# EAGLE board tc08-6u (EAGLE 6.6.0), part 1 of 9
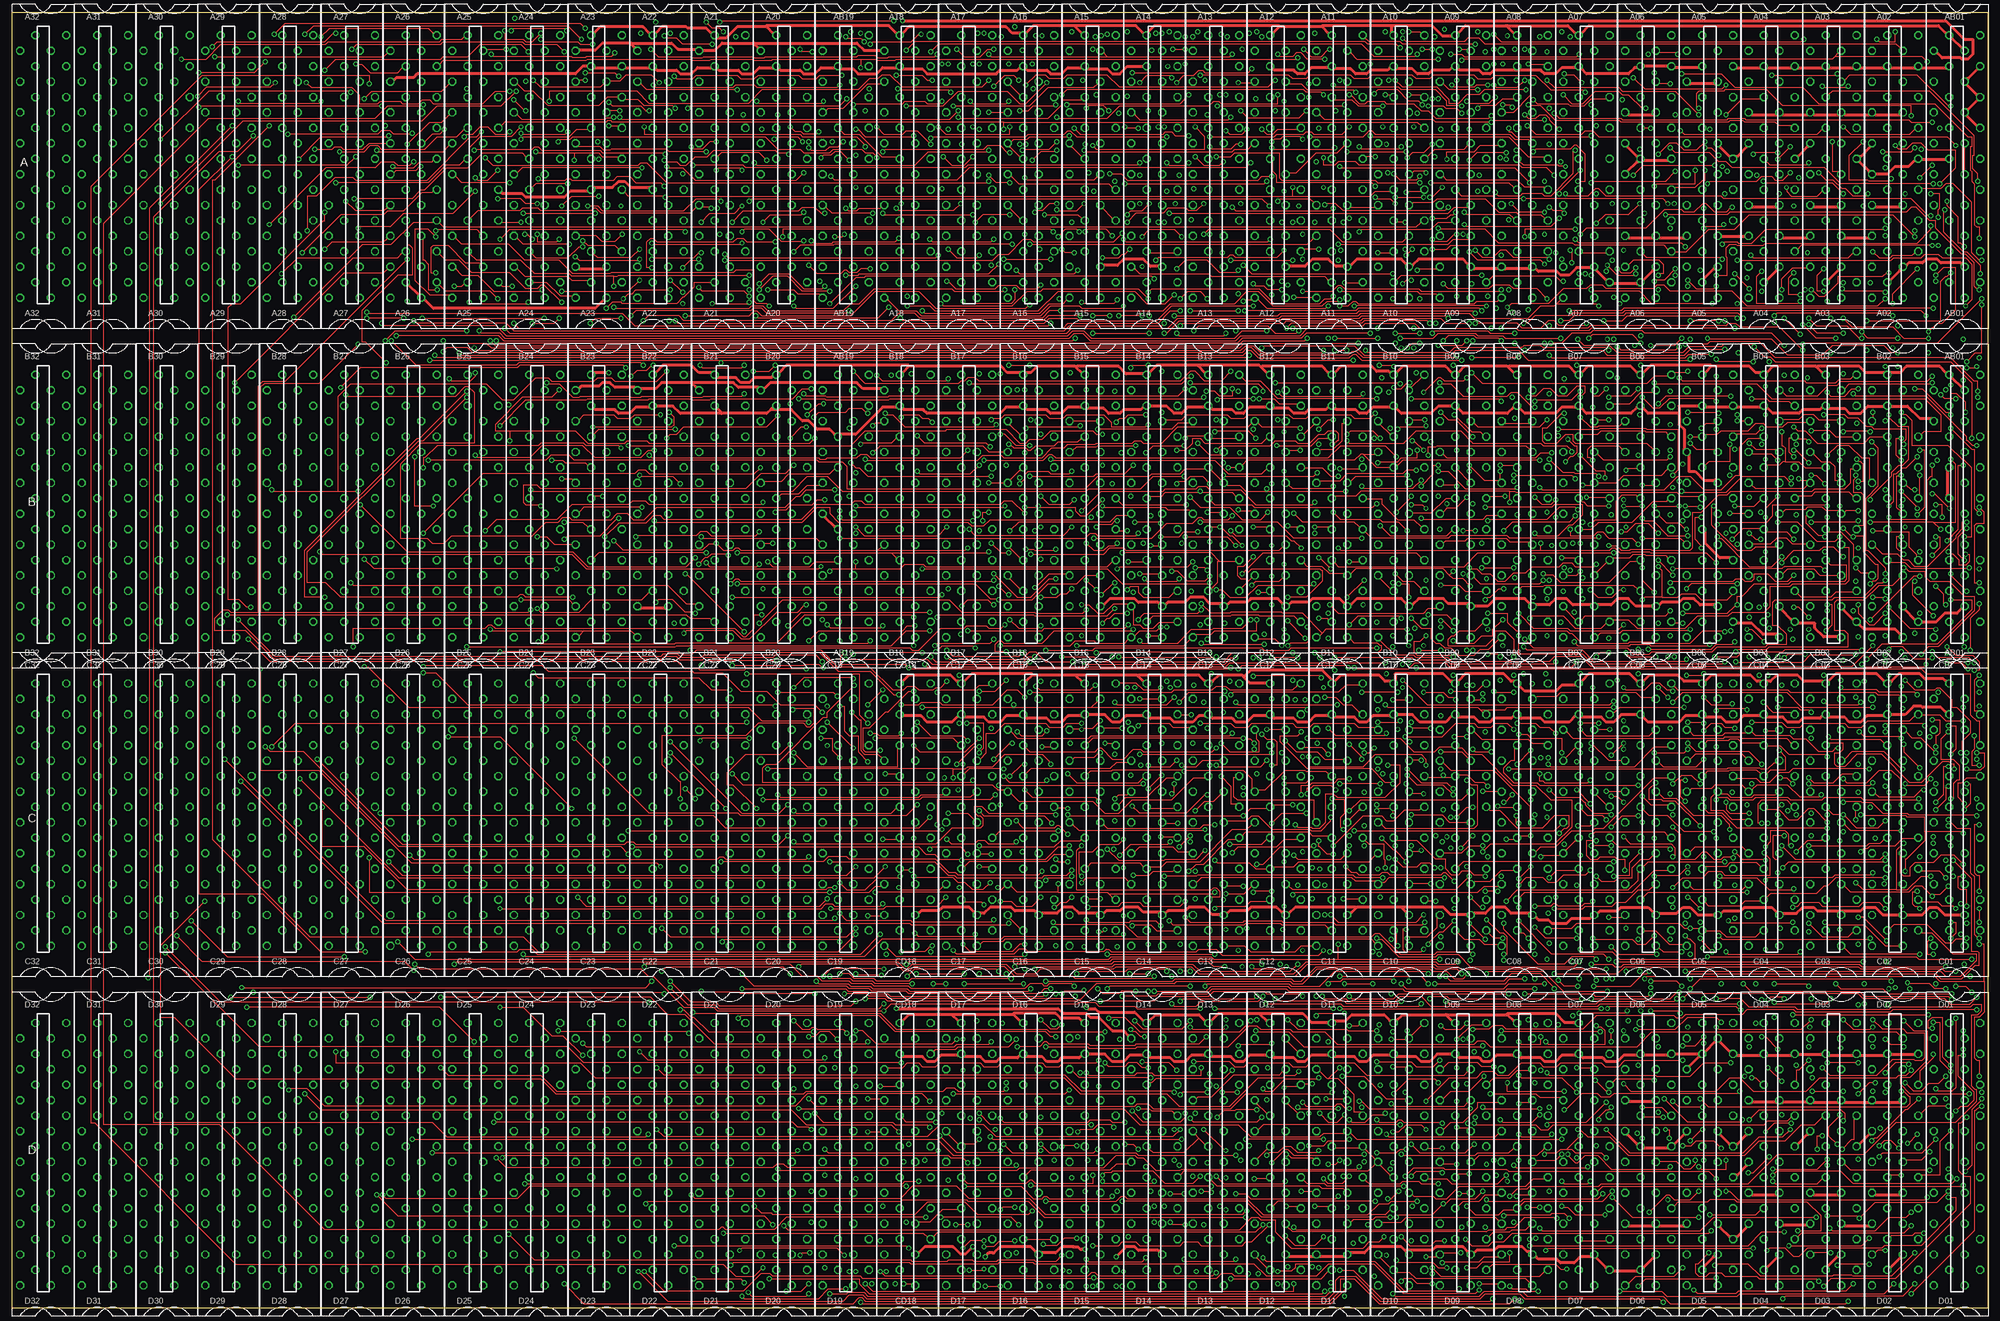
[diagram p12: board, top side]
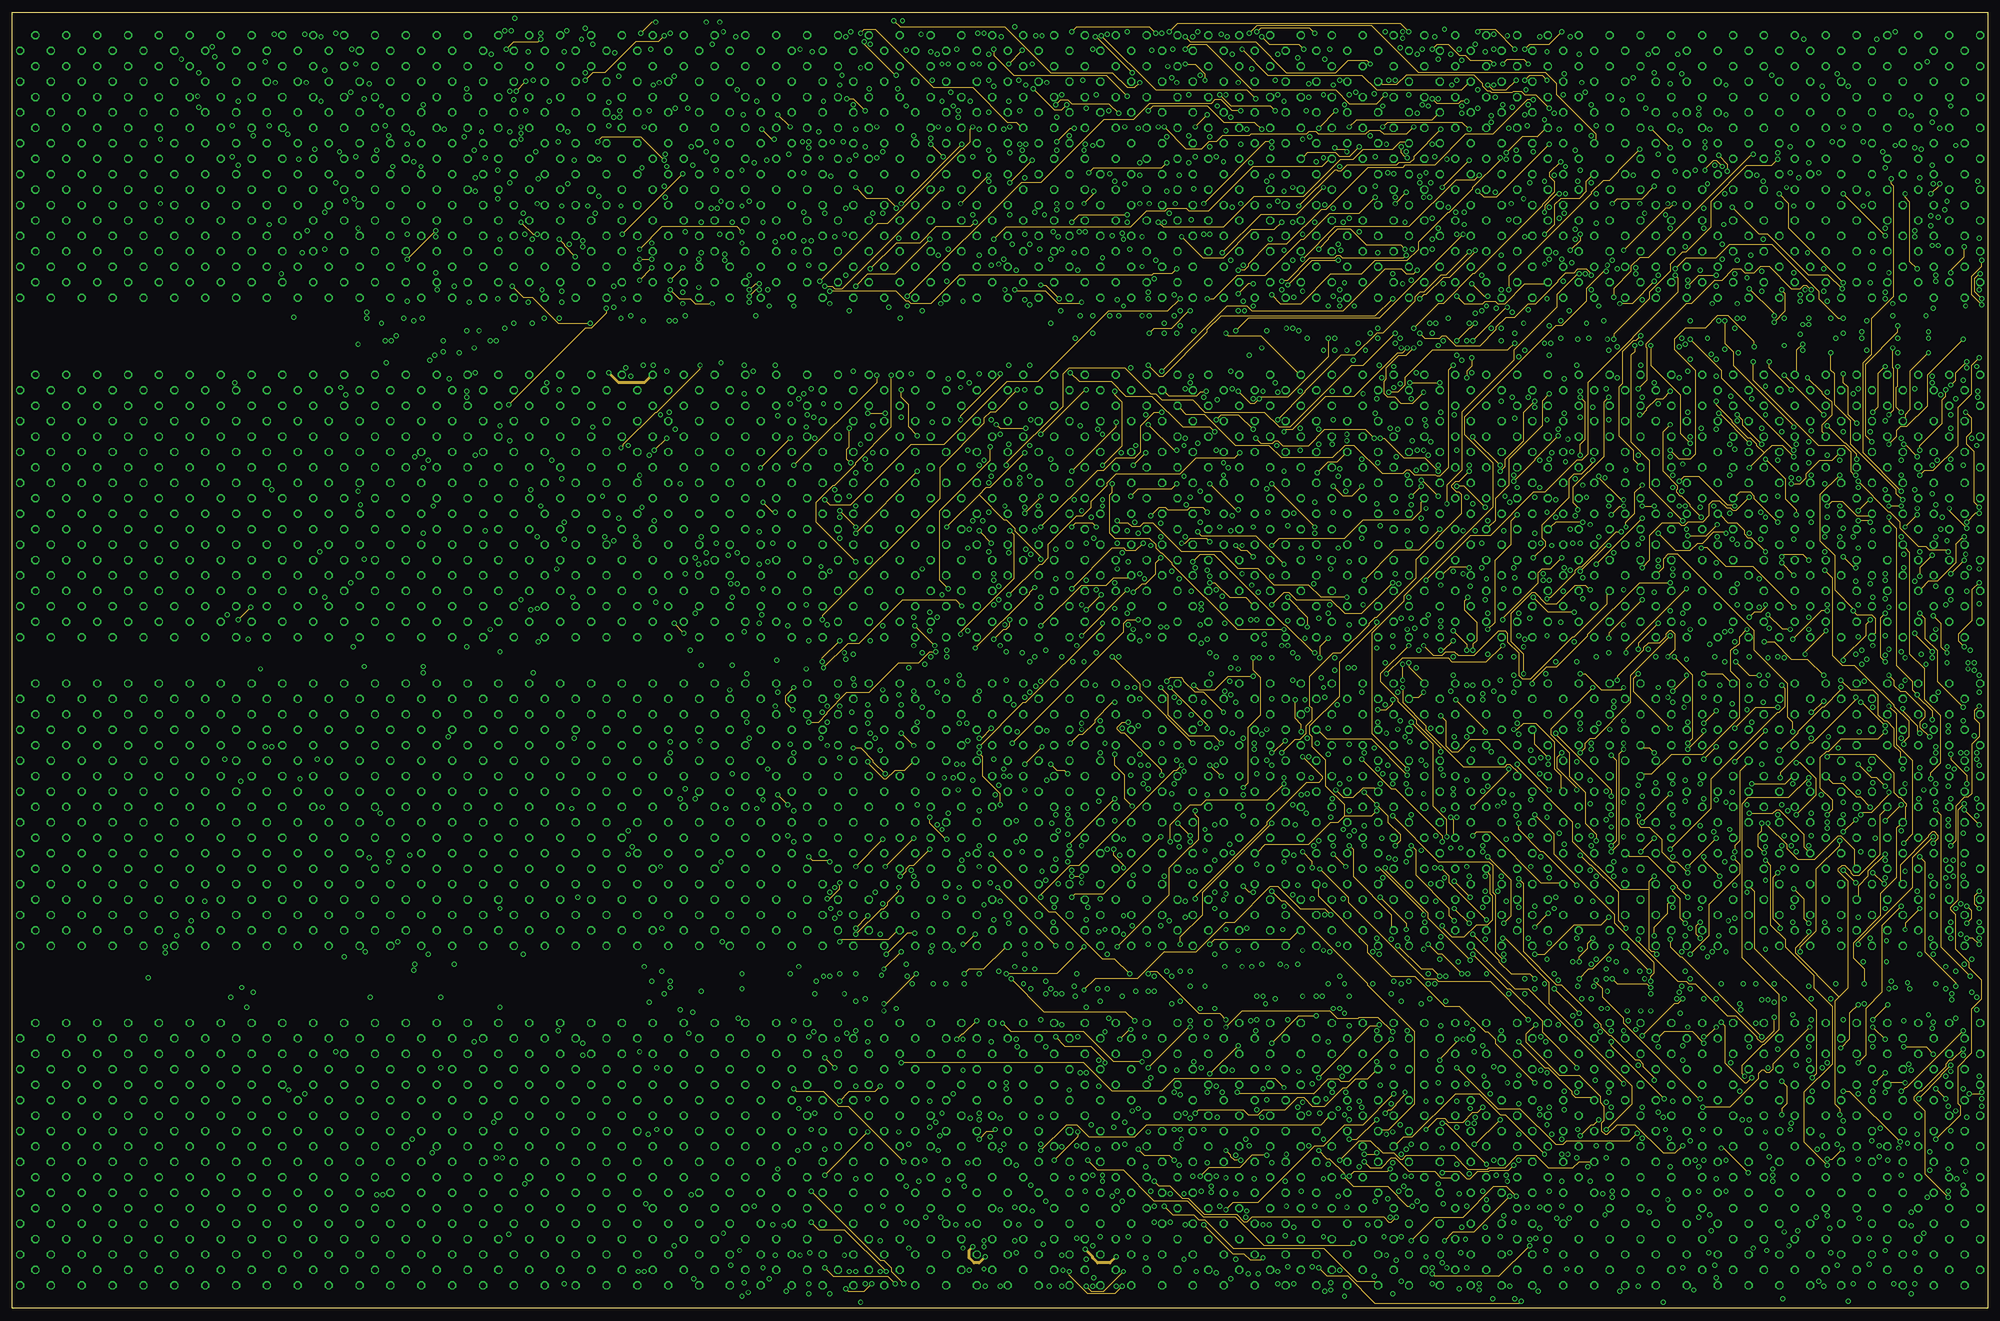
[diagram p13: board, inner layer Route2]
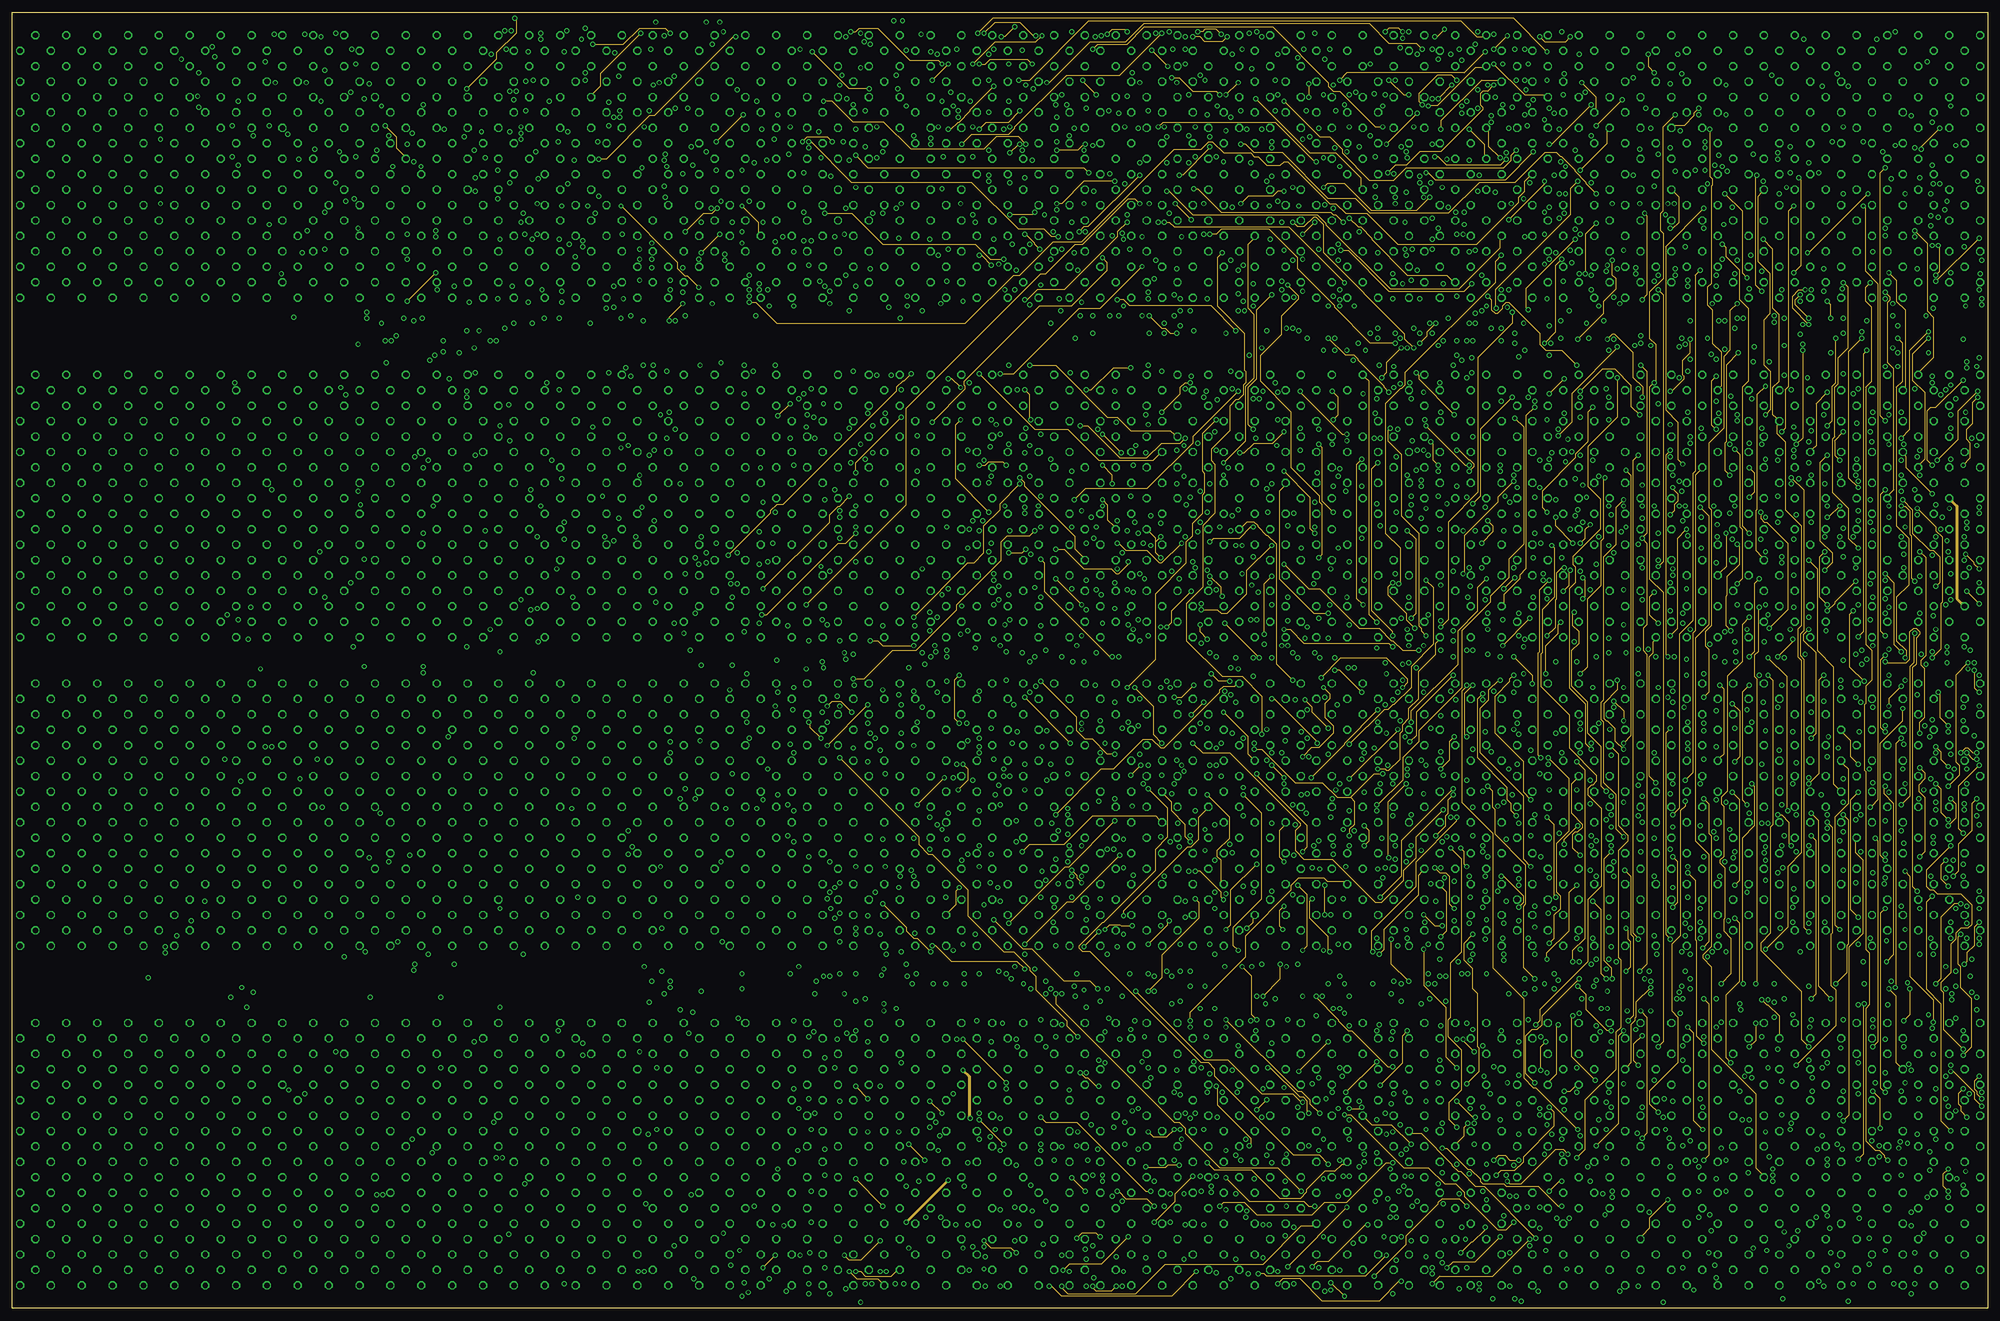
[diagram p14: board, inner layer Route15]
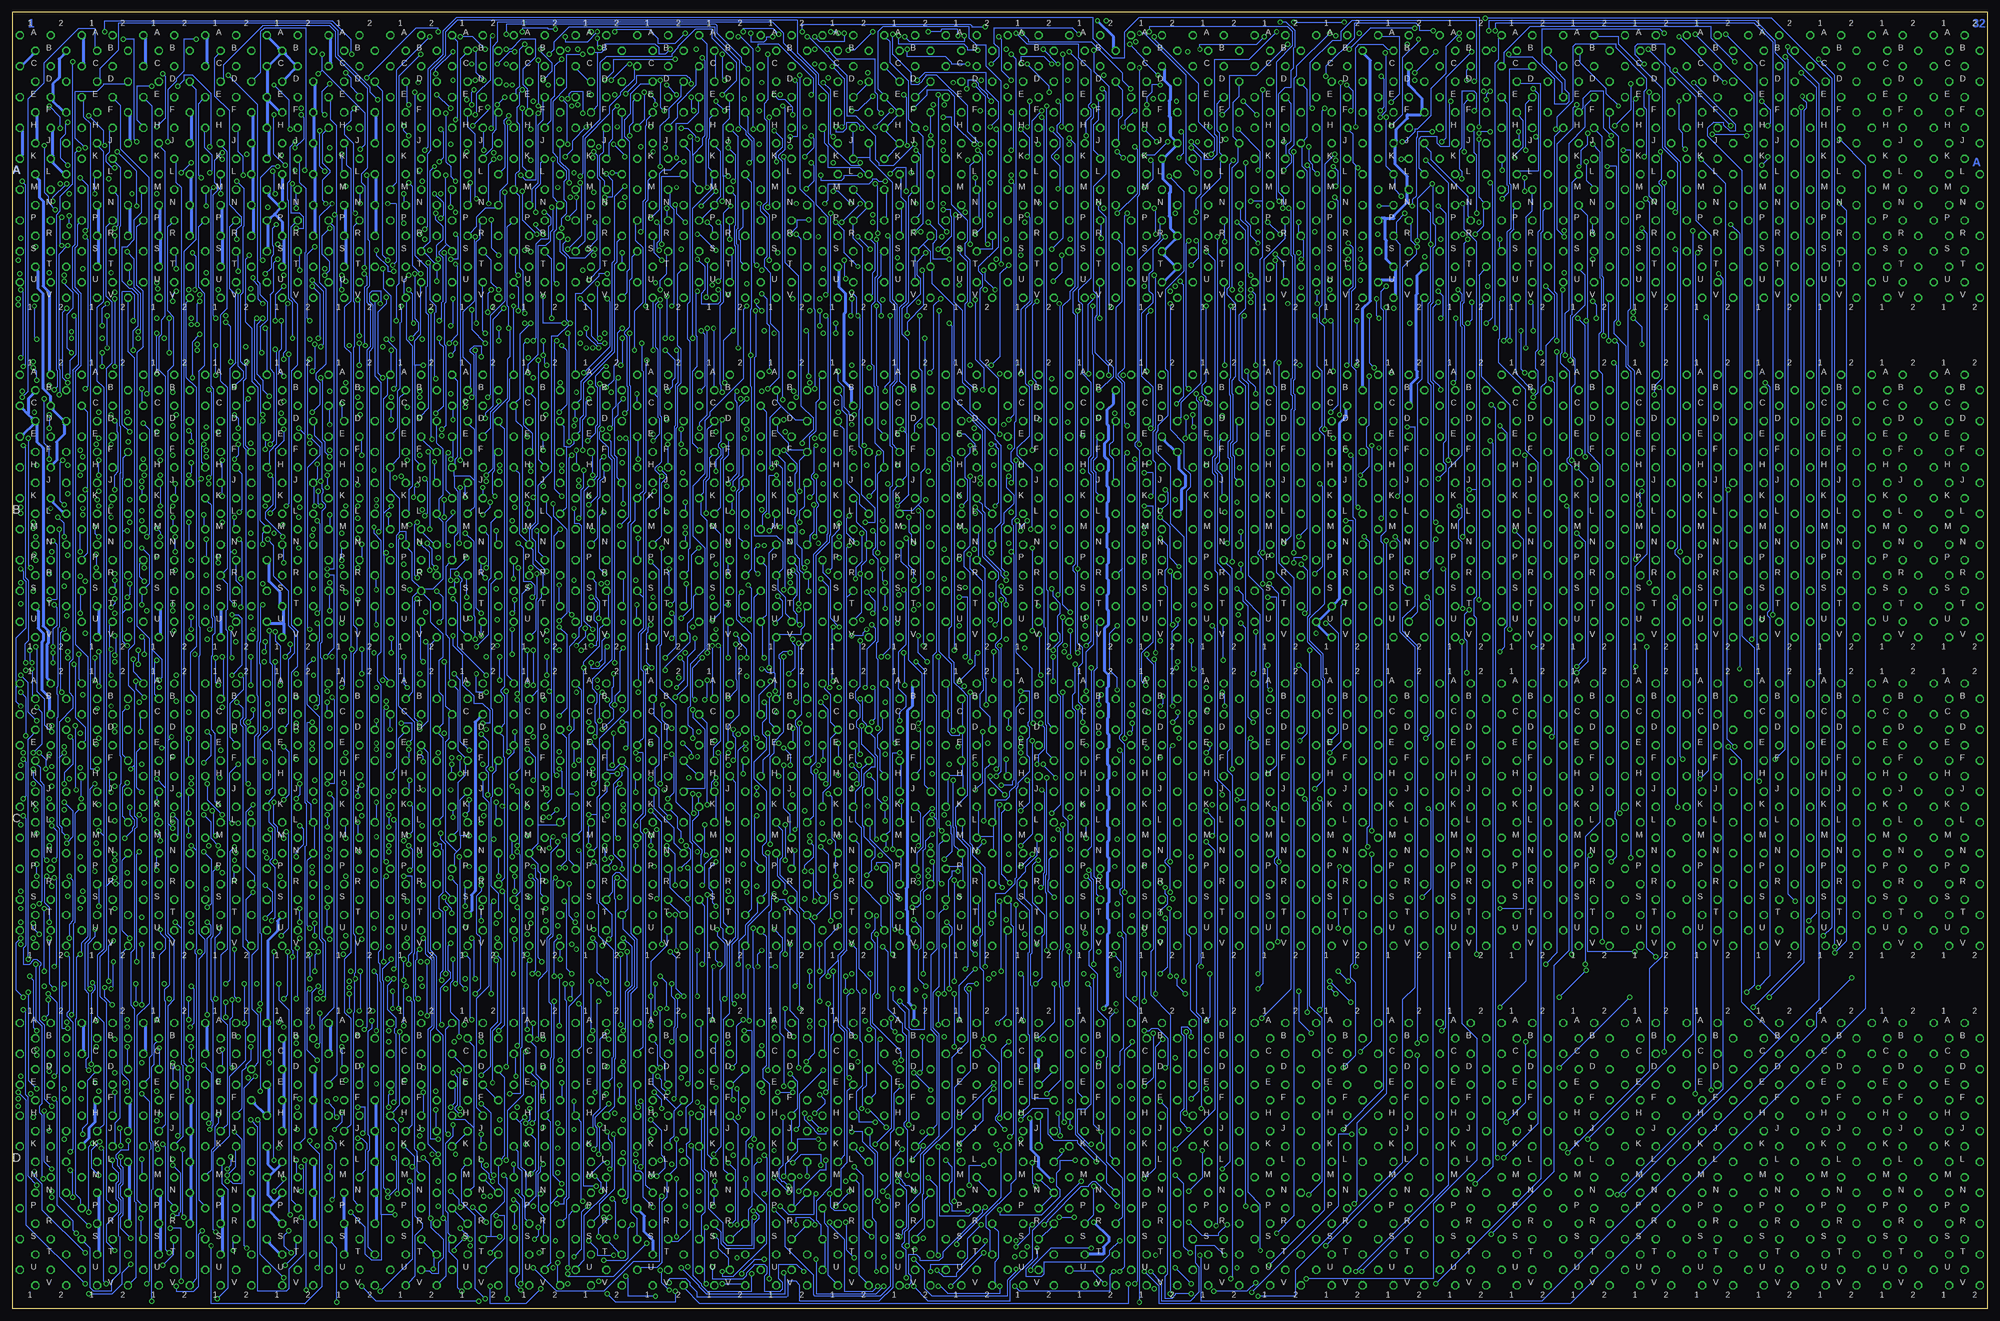
[diagram p15: board, bottom side, seen from below]

Size 406.46 x 266.69 mm. Coordinates in mm from the lower left corner, seen from the top.
Outline: 406.43,0 0,0 0.03,266.67 406.46,266.69 406.43,0
Copper layers (1*2*15*16): Top 0.035mm / dielectric 1.5mm / Route2 0.035mm / dielectric 0.15mm / Route15 0.035mm / dielectric 0.2mm / Bottom 0.035mm
Design rules "10mils": minimum track width 10mil, minimum drill 24mil, track to track 10mil, track to pad 10mil, pad to pad 10mil, via to via 10mil, smd to smd 10mil, copper to edge 25mil, drill to drill 10mil, minimum pad ring 10mil, minimum via ring 8mil, stop-mask expansion 0mil, vias tented up to drill 0mil, thermal gap 10mil
Net classes: 1 Power: width 0.635 mm, drill 0.381 mm, clearance 0.381 mm

## Footprints (pad centres in the part's own frame; a part is rotated, then mirrored left to right if it is on the bottom)
H807 = drill 1.092 octagon: A1 4.763,28.575; A2 -1.587,28.575; B1 1.587,25.4; B2 -4.763,25.4; C1 4.763,22.225; C2 -1.587,22.225; D1 1.587,19.05; D2 -4.763,19.05; E1 4.763,15.875; E2 -1.587,15.875; F1 1.587,12.7; F2 -4.763,12.7; H1 4.763,9.525; H2 -1.587,9.525; J1 1.587,6.35; J2 -4.763,6.35; K1 4.763,3.175; K2 -1.587,3.175; L1 1.587,0; L2 -4.763,0; M1 4.763,-3.175; M2 -1.587,-3.175; N1 1.587,-6.35; N2 -4.763,-6.35; P1 4.763,-9.525; P2 -1.587,-9.525; R1 1.587,-12.7; R2 -4.763,-12.7; S1 4.763,-15.875; S2 -1.587,-15.875; T1 1.587,-19.05; T2 -4.763,-19.05; U1 4.763,-22.225; U2 -1.587,-22.225; V1 1.587,-25.4; V2 -4.763,-25.4
H807-2 = drill 1.092 octagon: AA1 4.763,60.325; AA2 -1.587,60.325; AB1 1.587,57.15; AB2 -4.763,57.15; AC1 4.763,53.975; AC2 -1.587,53.975; AD1 1.587,50.8; AD2 -4.763,50.8; AE1 4.763,47.625; AE2 -1.587,47.625; AF1 1.587,44.45; AF2 -4.763,44.45; AH1 4.763,41.275; AH2 -1.587,41.275; AJ1 1.587,38.1; AJ2 -4.763,38.1; AK1 4.763,34.925; AK2 -1.587,34.925; AL1 1.587,31.75; AL2 -4.763,31.75; AM1 4.763,28.575; AM2 -1.587,28.575; AN1 1.587,25.4; AN2 -4.763,25.4; AP1 4.763,22.225; AP2 -1.587,22.225; AR1 1.587,19.05; AR2 -4.763,19.05; AS1 4.763,15.875; AS2 -1.587,15.875; AT1 1.587,12.7; AT2 -4.763,12.7; AU1 4.763,9.525; AU2 -1.587,9.525; AV1 1.587,6.35; AV2 -4.763,6.35; BA1 4.763,-9.525; BA2 -1.587,-9.525; BB1 1.587,-12.7; BB2 -4.763,-12.7; BC1 4.763,-15.875; BC2 -1.587,-15.875; BD1 1.587,-19.05; BD2 -4.763,-19.05; BE1 4.763,-22.225; BE2 -1.587,-22.225; BF1 1.587,-25.4; BF2 -4.763,-25.4; BH1 4.763,-28.575; BH2 -1.587,-28.575; BJ1 1.587,-31.75; BJ2 -4.763,-31.75; BK1 4.763,-34.925; BK2 -1.587,-34.925; BL1 1.587,-38.1; BL2 -4.763,-38.1; BM1 4.763,-41.275; BM2 -1.587,-41.275; BN1 1.587,-44.45; BN2 -4.763,-44.45; BP1 4.763,-47.625; BP2 -1.587,-47.625; BR1 1.587,-50.8; BR2 -4.763,-50.8; BS1 4.763,-53.975; BS2 -1.587,-53.975; BT1 1.587,-57.15; BT2 -4.763,-57.15; BU1 4.763,-60.325; BU2 -1.587,-60.325; BV1 1.587,-63.5; BV2 -4.763,-63.5

## Placement (x,y rotation side)
A02  M903  [H807]  387.39,233.35 0 top
A03  M903  [H807]  374.69,233.35 0 top
A04  M903  [H807]  361.99,233.35 0 top
A05  M903  [H807]  349.29,233.35 0 top
A06  M903  [H807]  336.59,233.35 0 top
A07  M161  [H807]  323.89,233.35 0 top
A08  M206  [H807]  311.19,233.35 0 top
A09  M117  [H807]  298.49,233.35 0 top
A10  M113  [H807]  285.79,233.35 0 top
A11  M111  [H807]  273.09,233.35 0 top
A12  M113  [H807]  260.39,233.35 0 top
A13  H807  [H807]  247.69,233.35 0 top
A14  M302  [H807]  234.99,233.35 0 top
A15  M627  [H807]  222.29,233.35 0 top
A16  M602  [H807]  209.59,233.35 0 top
A17  H807  [H807]  196.89,233.35 0 top
A18  G888  [H807]  184.19,233.35 0 top
A20  G888  [H807]  158.79,233.35 0 top
A21  G888  [H807]  146.09,233.35 0 top
A22  M502  [H807]  133.39,233.35 0 top
A23  M633  [H807]  120.69,233.35 0 top
A24  W023  [H807]  107.99,233.35 0 top
A25  M916  [H807]  95.29,233.35 0 top
A26  M916  [H807]  82.59,233.35 0 top
A27  H807  [H807]  69.89,233.35 0 top
A28  H807  [H807]  57.19,233.35 0 top
A29  H807  [H807]  44.49,233.35 0 top
A30  H807  [H807]  31.79,233.35 0 top
A31  H807  [H807]  19.09,233.35 0 top
A32  H807  [H807]  6.39,233.35 0 top
AB01  G821  [H807-2]  400.09,201.6 0 top
AB19  W032  [H807-2]  171.49,201.6 0 top
B02  M623  [H807]  387.39,163.5 0 top
B03  M623  [H807]  374.69,163.5 0 top
B04  M623  [H807]  361.99,163.5 0 top
B05  M623  [H807]  349.29,163.5 0 top
B06  M111  [H807]  336.59,163.5 0 top
B07  M207  [H807]  323.89,163.5 0 top
B08  M113  [H807]  311.19,163.5 0 top
B09  M206  [H807]  298.49,163.5 0 top
B10  M627  [H807]  285.79,163.5 0 top
B11  M115  [H807]  273.09,163.5 0 top
B12  M117  [H807]  260.39,163.5 0 top
B13  M206  [H807]  247.69,163.5 0 top
B14  M206  [H807]  234.99,163.5 0 top
B15  M113  [H807]  222.29,163.5 0 top
B16  M602  [H807]  209.59,163.5 0 top
B17  H807  [H807]  196.89,163.5 0 top
B18  G888  [H807]  184.19,163.5 0 top
B20  G888  [H807]  158.79,163.5 0 top
B21  G879  [H807]  146.09,163.5 0 top
B22  M633  [H807]  133.39,163.5 0 top
B23  W005  [H807]  120.69,163.5 0 top
B24  H807  [H807]  107.99,163.5 0 top
B25  H807  [H807]  95.29,163.5 0 top
B26  H807  [H807]  82.59,163.5 0 top
B27  H807  [H807]  69.89,163.5 0 top
B28  H807  [H807]  57.19,163.5 0 top
B29  H807  [H807]  44.49,163.5 0 top
B30  H807  [H807]  31.79,163.5 0 top
B31  H807  [H807]  19.09,163.5 0 top
B32  H807  [H807]  6.39,163.5 0 top
C01  M101  [H807]  400.09,100 0 top
C02  M101  [H807]  387.39,100 0 top
C03  M101  [H807]  374.69,100 0 top
C04  M103  [H807]  361.99,100 0 top
C05  M103  [H807]  349.29,100 0 top
C06  M111  [H807]  336.59,100 0 top
C07  M207  [H807]  323.89,100 0 top
C08  M121  [H807]  311.19,100 0 top
C09  M206  [H807]  298.49,100 0 top
C10  M121  [H807]  285.79,100 0 top
C11  M113  [H807]  273.09,100 0 top
C12  M115  [H807]  260.39,100 0 top
C13  M111  [H807]  247.69,100 0 top
C14  M206  [H807]  234.99,100 0 top
C15  M113  [H807]  222.29,100 0 top
C16  M627  [H807]  209.59,100 0 top
C17  M111  [H807]  196.89,100 0 top
C19  H807  [H807]  171.49,100 0 top
C20  H807  [H807]  158.79,100 0 top
C21  H807  [H807]  146.09,100 0 top
C22  H807  [H807]  133.39,100 0 top
C23  H807  [H807]  120.69,100 0 top
C24  H807  [H807]  107.99,100 0 top
C25  H807  [H807]  95.29,100 0 top
C26  H807  [H807]  82.59,100 0 top
C27  H807  [H807]  69.89,100 0 top
C28  H807  [H807]  57.19,100 0 top
C29  H807  [H807]  44.49,100 0 top
C30  H807  [H807]  31.79,100 0 top
C31  H807  [H807]  19.09,100 0 top
C32  H807  [H807]  6.39,100 0 top
CD18  M228  [H807-2]  184.19,68.25 0 top
D01  H807  [H807]  400.09,30.15 0 top
D02  M903  [H807]  387.39,30.15 0 top
D03  M903  [H807]  374.69,30.15 0 top
D04  M903  [H807]  361.99,30.15 0 top
D05  M903  [H807]  349.29,30.15 0 top
D06  M903  [H807]  336.59,30.15 0 top
D07  M161  [H807]  323.89,30.15 0 top
D08  M207  [H807]  311.19,30.15 0 top
D09  M121  [H807]  298.49,30.15 0 top
D10  M119  [H807]  285.79,30.15 0 top
D11  M206  [H807]  273.09,30.15 0 top
D12  M627  [H807]  260.39,30.15 0 top
D13  M602  [H807]  247.69,30.15 0 top
D14  M307  [H807]  234.99,30.15 0 top
D15  M401  [H807]  222.29,30.15 0 top
D16  M302  [H807]  209.59,30.15 0 top
D17  M602  [H807]  196.89,30.15 0 top
D19  H807  [H807]  171.49,30.15 0 top
D20  H807  [H807]  158.79,30.15 0 top
D21  H807  [H807]  146.09,30.15 0 top
D22  H807  [H807]  133.39,30.15 0 top
D23  H807  [H807]  120.69,30.15 0 top
D24  H807  [H807]  107.99,30.15 0 top
D25  H807  [H807]  95.29,30.15 0 top
D26  H807  [H807]  82.59,30.15 0 top
D27  H807  [H807]  69.89,30.15 0 top
D28  H807  [H807]  57.19,30.15 0 top
D29  H807  [H807]  44.49,30.15 0 top
D30  H807  [H807]  31.79,30.15 0 top
D31  H807  [H807]  19.09,30.15 0 top
D32  H807  [H807]  6.39,30.15 0 top

## Tracks (layer width: path | path; a pad name or v marks a point on that pad's centre or on a via)
0_TO_DTB  (via drill 0.61)
  Top 0.254: v242.35,59.17 240.57,57.39 232.7,57.39 v230.92,59.17 | v205.52,67.81 184.95,67.81 184.44,67.3 177.84,67.3 177.33,67.81 173.26,67.81 172.25,68.82 v170.22,68.82 | v169.2,80.25 168.69,79.74 77,79.74 v43.72,113.02 | v102.65,262.88 103.16,263.39 113.57,263.39 v114.08,262.88 | v136.18,253.48 136.69,252.97 139.99,252.97 140.75,253.73 149.13,253.73 149.9,252.97 152.69,252.97 153.45,253.73 161.83,253.73 162.6,252.97 165.39,252.97 166.15,253.73 v170.72,253.73 | v176.57,260.08 177.07,260.59 184.95,260.59 186.47,262.12 v186.98,262.12
  Route2 0.254: v230.92,59.17 229.14,60.95 212.38,60.95 v205.52,67.81 | v205.01,256.02 v207.81,258.81 | v224.06,261.86 235.24,250.69 254.04,250.69 v255.81,248.91
  Route15 0.254: v242.35,59.17 242.35,60.95 253.78,72.38 253.78,76.7 263.18,86.09 263.18,87.11 264.7,88.63 269.78,88.63 270.55,87.87 274.1,87.87 C11.R1 | v255.81,248.91 266.99,237.73 272.32,237.73 277.4,232.65 277.4,230.87 A11.M1
  Bottom 0.254: v170.22,68.82 168.69,70.35 168.69,79.74 v169.2,80.25 | v43.72,113.02 41.69,115.05 41.69,256.27 43.72,258.31 43.72,260.85 47.79,264.91 102.65,264.91 v102.65,262.88 | v114.08,262.88 116.88,262.88 116.88,263.64 117.64,264.4 130.34,264.4 130.34,261.35 136.18,255.51 v136.18,253.48 | v170.72,253.73 173.52,256.53 173.52,257.04 v176.57,260.08 | v186.98,262.12 188.25,263.39 204.51,263.39 204.51,260.34 203.49,259.32 203.49,257.54 v205.01,256.02 | v207.81,258.81 209.84,258.81 209.84,259.32 210.6,260.08 224.06,260.08 v224.06,261.86
0_TO_EF  (via drill 0.61)
  Top 0.254: v281.98,247.38 276.9,247.38 275.63,248.65 272.07,248.65 A11.E2
  Bottom 0.254: v281.98,247.38 282.99,246.37 282.99,240.53 283.75,239.76 283.75,237.22 A10.K2
0_TO_STA
  Top 0.254: A11.N1 275.37,226.56 280.45,226.56 A10.N2
1_TO_DF  (via drill 0.61)
  Top 0.254: v262.16,31.74 262.42,31.74 263.18,30.98 267.5,30.98 267.75,30.72 D11.L2 | v307.38,237.73 301.28,237.73 v299.76,236.21 | v294.17,230.62 292.14,228.59 v291.63,228.59 | v257.08,118.1 258.1,117.08 259.62,117.08 260.13,116.57 260.13,111.75 v259.12,111.75
  Route2 0.254: v307.38,237.73 310.68,241.03 313.73,241.03 315.25,242.56 A08.H1 | v299.76,236.21 v294.17,230.62 | v269.78,230.62 264.2,225.03 256.83,225.03 v248.96,217.16
  Route15 0.254: v261.4,77.97 260.64,78.73 260.64,81.78 v261.66,82.79 | v261.66,91.94 260.64,92.95 260.64,98.29 261.66,99.3 C12.L1 | v291.63,228.59 288.83,225.79 279.69,225.79 274.1,231.38 270.55,231.38 v269.78,230.62 | v248.96,217.16 247.94,216.14 247.94,206.24 253.53,200.65 253.53,193.03 253.78,192.77 253.78,190.49 253.27,189.98 253.27,187.95 252.26,186.93 251.75,186.93 250.48,185.66 250.48,180.58 246.67,176.77 246.67,174.49 247.43,173.72 247.43,163.56 244.89,161.02 244.89,148.32 241.59,145.02 241.59,137.4 248.96,130.04 253.02,130.04 257.08,125.97 v257.08,118.1 | v259.12,111.75 v261.66,109.21
  Bottom 0.254: C12.L1 261.66,100.57 261.66,105.65 C12.J1 262.67,106.67 262.67,108.19 v261.66,109.21 | v262.16,31.74 260.64,33.26 260.64,63.23 260.89,63.49 260.89,69.58 259.88,70.6 259.88,75.17 261.4,76.7 v261.4,77.97 | v261.66,82.79 262.42,83.55 262.42,85.84 263.18,86.6 263.18,90.41 v261.66,91.94
1_TO_DTF  (via drill 0.61)
  Route2 0.254: v255.31,133.85 255.31,131.31 256.83,129.78 256.83,122.16 254.29,119.62 254.29,108.19 v253.27,107.18
  Route15 0.254: v259.12,150.61 257.59,149.09 v257.59,138.67 | v253.27,105.65 257.08,101.84 257.08,84.32 251.24,78.47 251.24,74.66 v252.26,73.65 | v253.02,70.35 255.05,68.31 255.05,60.44 v256.07,59.42 | v258.35,49.52 258.86,49.52 264.96,43.42 265.72,43.42 266.48,42.66 266.48,40.37 v266.74,40.12
  Bottom 0.254: v259.12,150.61 259.12,153.4 B12.P2 | v257.59,138.67 256.83,137.91 256.83,137.15 255.31,135.62 v255.31,133.85 | v253.27,105.65 v253.27,107.18 | v252.26,73.65 253.02,72.89 v253.02,70.35 | v256.07,59.42 257.34,58.15 257.34,50.53 v258.35,49.52 | v266.74,40.12 266.99,39.87 266.99,34.53 267.75,33.77 267.75,31.48 266.99,30.72 266.99,16.24 269.53,13.7 270.8,13.7 270.8,13.96 D11.S2
76  (via drill 0.61)
  Top 0.254: v356.91,85.59 336.59,85.59 335.57,84.57 C06.S2
  Bottom 0.254: v356.91,85.59 358.43,84.06 358.43,75.93 357.67,75.17 C04.V2
76+77  (via drill 0.61)
  Top 0.254: v285.79,5.58 286.29,6.08 288.07,6.08 289.09,5.07 v292.14,5.07 | v314.23,16.5 314.74,15.99 347.25,15.99 350.05,18.78 v371.13,18.78 | v371.38,32.75 371.38,35.55 v372.4,35.55 | v372.4,49.52 373.92,47.99 383.58,47.99 386.88,51.3 391.2,51.3 391.45,51.04 392.97,51.04 393.48,51.55 393.48,56.63 389.93,56.63 389.16,57.39 384.85,57.39 v382.81,59.42 | v388.66,117.34 388.4,117.59 381.04,117.59 v380.02,118.61
  Route2 0.254: v382.81,59.42 v385.86,62.47
  Route15 0.254: v260.39,5.07 261.4,6.08 264.96,6.08 269.53,1.51 281.21,1.51 285.28,5.58 v285.79,5.58 | v292.14,5.07 293.66,6.59 304.58,6.59 v312.2,14.21 | v387.39,66.03 387.64,66.28 387.64,116.32 v388.66,117.34
  Bottom 0.254: v260.39,5.07 256.32,5.07 D12.V2 | v312.2,14.21 312.46,14.47 312.46,14.72 v314.23,16.5 | v371.13,18.78 371.38,19.04 v371.38,32.75 | v372.4,35.55 371.89,36.06 371.89,49.01 v372.4,49.52 | v385.86,62.47 387.39,64 v387.39,66.03 | v380.02,118.61 380.02,121.65 C03.C1
77
  Top 0.254: C06.U2 335.57,77.71 338.11,77.71 340.9,74.92 343.95,74.92 C05.V2
!00  (via drill 0.61)
  Top 0.254: v107.99,144.01 108.75,143.24 116.62,143.24 119.16,145.78 129.58,145.78 131.1,147.31 B22.S2 | v108.75,165.09 108.49,165.34 105.7,165.34 105.19,165.85 105.19,169.41 107.99,169.41 108.75,168.64 150.91,168.64 153.96,171.69 159.04,171.69 v160.82,173.47 | v177.84,192.01 179.11,190.74 192.06,190.74 v192.57,191.25 | v195.62,207.25 196.12,206.74 205.52,206.74 206.28,207.51 v206.28,209.54 | v220,207 220.25,206.74 226.6,206.74 v227.37,207.51
  Route2 0.254: v160.82,173.47 177.84,190.49 v177.84,192.01 | v206.28,209.54 206.54,209.28 212.63,209.28 215.17,206.74 219.75,206.74 v220,207 | v251.75,201.16 254.29,203.7 281.21,203.7 v298.49,220.97 | v301.53,229.86 302.8,228.59 305.34,228.59 v316.27,239.51
  Route15 0.254: v192.57,191.25 193.33,191.25 v195.11,189.47 | v227.37,207.51 228.64,207.51 229.91,206.24 246.67,206.24 v251.75,201.16 | v316.27,239.51 316.77,239.51 v324.9,247.64
  Bottom 0.254: v107.99,144.01 108.24,144.26 108.24,157.72 109,158.48 109,162.04 108.24,162.8 108.24,164.58 v108.75,165.09 | v195.11,189.47 195.87,190.23 195.87,190.74 196.63,191.5 196.63,206.24 v195.62,207.25 | v298.49,220.97 301.53,224.02 v301.53,229.86 | v324.9,247.64 325.16,247.89 325.16,251.7 A07.D1
!0_TO_AC  (via drill 0.61)
  Top 0.254: v331.51,140.7 330.24,139.43 320.58,139.43 320.08,139.94 312.96,139.94 v309.92,142.99 | v311.19,197.09 327.19,197.09 328.2,196.08 343.95,196.08 345.22,197.35 v352.33,197.35
  Bottom 0.254: v331.51,140.7 331.51,143.75 B06.T2 | v309.92,142.99 310.93,144.01 310.93,196.84 v311.19,197.09 | v352.33,197.35 352.08,197.09 352.08,177.79 353.6,176.26 353.6,173.72 B05.H1
!0_TO_DTB  (via drill 0.61)
  Top 0.254: B10.L1 288.07,163.56 291.88,163.56 294.93,166.61 296.2,166.61 B09.K2 | v295.95,126.99 301.28,126.99 302.55,128.26 C09.A1 | v303.31,206.24 v276.13,206.24
  Bottom 0.254: 295.44,126.99 295.44,162.55 296.45,163.56 296.45,166.1 B09.K2 | 295.44,126.99 295.44,104.89 296.45,103.87 C09.K2 | 295.44,126.99 v295.95,126.99 | C09.A1 303.57,129.27 304.58,130.29 304.58,186.42 304.07,186.93 304.07,191.25 303.82,191.5 B09.A1 303.31,192.77 v303.31,206.24 | v276.13,206.24 276.13,227.57 275.63,228.08 275.63,232.14 275.12,232.65 A11.L1
!0_TO_EF  (via drill 0.61)
  Top 0.254: A11.F2 269.02,245.61 270.04,244.59 292.39,244.59 292.9,244.08 v304.33,244.08 304.58,244.34 315,244.34 v315.25,244.59
  Bottom 0.254: v304.33,244.08 304.58,243.83 304.58,231.38 306.11,229.86 306.11,227.57 A08.N2 306.87,226.3 309.15,226.3 310.93,224.52 310.93,222.49 312.2,221.22 A08.R1 | v315.25,244.59 314.74,245.1 314.74,260.59 315.5,261.35 A08.A1
!0_TO_LPB  (via drill 0.61)
  Top 0.254: v309.92,35.8 310.42,35.29 316.27,35.29 v316.77,35.8 | v285.53,37.83 257.34,37.83 256.32,36.82 D12.J2 | v285.79,31.74 286.04,31.48 301.03,31.48 301.53,31.99 307.88,31.99 308.9,33.01 D08.K2
  Bottom 0.254: v309.92,35.8 309.92,34.02 D08.K2 | v316.77,35.8 317.28,36.31 317.28,57.39 316.52,58.15 D08.A1 | v285.53,37.83 285.53,31.99 v285.79,31.74
!0_TO_STA  (via drill 0.61)
  Top 0.254: v329.47,155.44 301.53,155.44 298.74,152.64 272.83,152.64 272.07,153.4 B11.P2 | v328.46,165.09 324.14,165.09 323.38,165.85 323.12,165.85 322.87,166.1 B07.K2 | v278.42,197.09 278.93,196.58 295.69,196.58 296.71,197.6 310.42,197.6 310.93,198.11 314.49,198.11 315,197.6 327.95,197.6 v328.46,197.09
  Bottom 0.254: v329.47,155.44 329.98,154.93 | 329.98,154.93 329.98,130.29 328.97,129.27 C07.A1 | 329.98,163.56 v328.46,165.09 | 329.98,154.93 329.98,163.56 | 329.98,163.56 329.98,187.19 329.22,187.95 329.22,191.5 B07.A1 328.46,192.77 v328.46,197.09 | v278.42,197.09 278.42,205.22 276.64,207 276.64,218.17 278.17,219.7 278.17,223.25 A11.P1
!0_TO_STATE  (via drill 0.61)
  Top 0.254: v208.32,72.89 207.81,72.38 181.9,72.38 180.12,74.16 CD18.AV2
  Bottom 0.254: v208.32,72.89 209.33,73.9 209.33,94.98 210.86,96.51 210.86,99.3 C16.L1
!0_TO_W  (via drill 0.61)
  Top 0.254: v190.03,38.34 183.93,38.34 183.17,39.1 CD18.BH2 | v190.28,99.56 190.28,104.64 201.2,104.64 v202.22,105.65 | v205.27,109.46 207.81,112 v208.32,112 | v211.87,115.56 213.65,115.56 C16.E1
  Route2 0.254: v208.32,112 v211.87,115.56
  Bottom 0.254: v190.03,38.34 190.28,38.6 190.28,66.28 190.54,66.54 190.54,73.39 190.28,73.65 v190.28,99.56 | v202.22,105.65 205.27,108.7 v205.27,109.46
!01  (via drill 0.61)
  Top 0.254: v141.26,210.05 142.02,209.28 150.66,209.28 v151.67,208.27 | v153.71,209.54 156.5,212.33 159.55,212.33 162.6,209.28 v168.18,209.28 | v239.56,213.86 241.34,215.63 245.91,215.63 248.45,213.09 251.75,213.09 v252.26,213.6 | v312.96,248.65 313.73,247.89 320.08,247.89 320.58,247.38 323.38,247.38 324.9,248.91 327.95,248.91 A07.E1
  Route2 0.254: v151.67,208.27 152.94,209.54 v153.71,209.54 | v168.18,209.28 181.9,209.28 183.93,207.25 184.44,207.25 184.95,206.74 189.01,206.74 194.85,212.59 234.48,212.59 234.73,212.84 238.54,212.84 v239.56,213.86 | v252.26,213.6 253.53,213.6 254.29,214.36 254.29,214.87 258.35,218.94 262.16,218.94 269.28,226.05 270.29,226.05 278.93,234.68 286.04,234.68 286.55,235.19 292.64,235.19 298.99,241.54 304.58,241.54 311.69,248.65 v312.96,248.65
  Route15 0.254: v125.26,226.81 136.94,215.13 136.94,213.86 138.47,212.33 138.97,212.33 v141.26,210.05
  Bottom 0.254: v125.26,226.81 122.97,226.81 A23.N1
!02  (via drill 0.61)
  Top 0.254: v117.89,252.72 116.62,252.72 A23.D2 | v134.15,261.86 134.66,261.35 136.69,261.35 137.96,260.08 v144.05,260.08 | v160.06,243.07 161.07,242.05 162.34,242.05 162.85,241.54 165.39,241.54 v165.9,242.05 | v166.41,236.72 166.91,237.22 168.44,237.22 169.2,237.99 170.47,237.99 v172.25,236.21 | v181.9,226.3 182.41,225.79 193.58,225.79 v195.11,227.32 | v200.95,233.16 202.47,231.64 v205.27,231.64 | v209.84,236.21 211.62,237.99 214.67,237.99 v214.92,238.24
  Route2 0.254: v117.89,252.72 119.42,254.24 121.96,254.24 128.31,260.59 132.88,260.59 v134.15,261.86 | v160.06,243.07 v157.52,245.61 | v173.52,230.62 175.8,228.33 180.12,228.33 181.9,226.56 v181.9,226.3 | v200.95,233.16 v195.11,227.32 | v209.84,236.21 v205.27,231.64 | v254.54,262.37 256.07,263.89 279.69,263.89 289.34,254.24 315.5,254.24 317.79,251.96 317.79,249.67 325.92,241.54 325.92,240.27 A07.J1
  Route15 0.254: v214.92,238.24 219.24,238.24 220.51,239.51 v220.76,239.51 | v242.86,261.61 244.38,261.61 245.4,260.59 248.96,260.59 v249.97,261.61
  Bottom 0.254: v144.05,260.08 150.4,253.73 155.99,253.73 155.99,247.13 v157.52,245.61 | v165.9,242.05 165.39,241.54 165.39,237.73 v166.41,236.72 | v172.25,236.21 171.74,235.7 171.74,232.4 v173.52,230.62 | v220.76,239.51 225.08,235.19 228.13,235.19 228.13,235.7 228.89,236.46 228.89,241.29 232.95,245.35 234.73,245.35 234.73,253.73 242.61,261.61 v242.86,261.61 | v249.97,261.61 251.24,261.61 251.24,261.1 251.75,260.59 254.54,260.59 v254.54,262.37
!03  (via drill 0.61)
  Top 0.254: v142.78,264.66 144.05,263.39 145.58,263.39 v146.34,262.62 | v215.17,220.46 216.7,221.98 218.98,221.98 v219.49,221.48 | v246.42,239 246.92,238.49 250.73,238.49 251.75,239.51 v252.77,239.51
  Route2 0.254: v129.32,262.37 131.61,264.66 v132.37,264.66
  Route15 0.254: v129.32,262.37 120.94,253.99 120.94,251.45 119.42,249.92 A23.E2 | v163.87,240.02 164.37,240.02 172.76,231.64 197.39,231.64 207.05,221.98 212.38,221.98 213.9,220.46 v215.17,220.46 | v219.49,221.48 220.51,222.49 221.27,222.49 v231.94,233.16 | v240.07,233.16 240.83,233.16 246.42,238.75 v246.42,239 | v252.77,239.51 253.78,239.51 255.56,237.73 261.4,237.73 270.8,228.33 276.39,228.33 279.44,225.29 295.44,225.29 301.79,231.64 309.15,231.64 315.25,237.73 317.79,237.73 318.55,236.97 318.81,236.97 321.6,234.18 321.6,233.92 323.89,231.64 323.89,231.38 v325.92,229.35
  Bottom 0.254: v142.78,264.66 v132.37,264.66 | v146.34,262.62 151.93,257.04 159.04,257.04 159.04,241.54 158.53,241.03 158.53,237.48 159.55,236.46 161.33,236.46 161.33,237.48 v163.87,240.02 | v231.94,233.16 235.24,233.16 235.24,232.65 235.75,232.14 240.07,232.14 v240.07,233.16 | v325.92,229.35 325.92,227.57 A07.N1
!04  (via drill 0.61)
  Top 0.254: v162.09,259.07 162.6,258.56 v164.63,258.56 | v319.31,253.99 319.57,253.73 321.35,253.73 v322.87,252.21
  Route15 0.254: v120.69,236.46 122.21,236.46 131.1,245.35 132.12,245.35 148.37,261.61 v148.88,261.61 | v164.63,258.56 172.25,250.94 v176.31,250.94 | v198.66,262.37 201.71,265.42 308.9,265.42 v315.76,258.56 | v322.87,252.21 325.92,249.16 325.92,246.62 A07.F1
  Bottom 0.254: v120.69,236.46 119.67,236.46 A23.K2 | v148.88,261.61 150.4,260.08 162.09,260.08 v162.09,259.07 | v176.31,250.94 178.09,252.72 178.09,254.24 184.44,260.59 197.39,260.59 197.39,261.1 v198.66,262.37 | v315.76,258.56 319.31,255 v319.31,253.99
!05  (via drill 0.61)
  Top 0.254: v110.53,248.4 110.53,250.43 128.56,250.43 131.1,247.89 151.42,247.89 154.21,250.69 174.03,250.69 176.31,252.97 178.09,252.97 178.85,253.73 180.63,253.73 183.17,251.19 199.43,251.19 v200.95,252.72
  Route2 0.254: v256.07,262.62 256.83,263.39 266.99,263.39 v268.01,262.37 | v301.53,262.62 302.04,263.13 305.09,263.13 v309.15,259.07
  Route15 0.254: v203.49,261.61 204.25,261.61 v206.28,263.64 | v243.88,262.62 244.89,262.62 245.4,263.13 247.69,263.13 v248.7,262.12 | v282.48,262.62 283.25,263.39 285.28,263.39 v286.04,262.62 | v292.64,261.61 293.15,261.61 v294.68,263.13 | v314.23,261.61 315.25,260.59 319.57,260.59 v320.58,261.61
  Bottom 0.254: v110.53,248.4 110.78,248.15 110.78,239 112.56,239 113.32,239.76 113.32,241.03 116.62,241.03 117.13,240.53 117.13,234.68 116.37,233.92 A23.L2 | v200.95,252.72 202.98,254.75 202.98,261.1 v203.49,261.61 | v206.28,263.64 209.08,263.64 209.08,263.89 209.33,264.15 243.88,264.15 v243.88,262.62 | v248.7,262.12 249.97,263.39 256.07,263.39 v256.07,262.62 | v268.01,262.37 270.04,260.34 273.59,260.34 273.59,261.35 275.37,263.13 282.48,263.13 v282.48,262.62 | v286.04,262.62 288.07,260.59 292.64,260.59 v292.64,261.61 | v294.68,263.13 296.2,263.13 296.2,263.39 301.53,263.39 v301.53,262.62 | v309.15,259.07 311.69,261.61 v314.23,261.61 | v320.58,261.61 327.44,254.75 327.44,231.64 328.2,230.87 A07.M1
!06  (via drill 0.61)
  Top 0.254: v125.51,220.97 123.99,219.44 121.45,219.44 120.18,220.71 116.62,220.71 A23.R2 | v139.74,239 140.24,238.49 142.02,238.49 143.55,240.02 v144.82,240.02 | v153.2,248.4 153.71,247.89 166.41,247.89 v166.91,248.4 | v221.02,246.88 221.52,247.38 224.57,247.38 v225.59,246.37 | v228.89,243.07 229.14,242.81 v231.68,242.81 | v308.39,227.32 310.17,225.54 v315.25,225.54 | v318.3,229.35 318.3,229.86 v322.62,234.18
  Route2 0.254: v137.96,233.41 v125.51,220.97 | v237.02,243.07 241.59,238.49 244.64,238.49 246.16,240.02 247.69,240.02 248.96,241.29 254.54,241.29 254.8,241.54 266.23,241.54 266.74,242.05 268.26,242.05 268.77,241.54 278.42,241.54 279.18,242.3 281.47,242.3 282.23,241.54 286.8,241.54 v288.33,243.07 | v315.25,225.54 315.25,226.81 317.79,229.35 v318.3,229.35
  Route15 0.254: v150.4,245.61 v144.82,240.02 | v166.91,248.4 168.69,248.4 173.01,244.08 179.36,244.08 184.95,238.49 199.93,238.49 202.47,241.03 207.05,241.03 v208.57,239.51 | v292.64,236.97 293.41,236.97 295.18,235.19 306.11,235.19 v307.38,236.46 | v322.62,234.18 328.2,239.76 328.2,242.3 A07.H1
  Bottom 0.254: v137.96,233.41 138.97,234.43 138.97,235.45 139.74,236.21 v139.74,239 | v153.2,248.4 v150.4,245.61 | v208.57,239.51 212.63,243.57 212.63,249.42 213.9,250.69 218.22,250.69 218.22,249.67 v221.02,246.88 | v228.89,243.07 v225.59,246.37 | v231.68,242.81 232.19,243.32 232.19,243.57 232.7,244.08 234.73,244.08 234.73,242.81 235.49,242.05 237.02,242.05 v237.02,243.07 | v288.33,243.07 291.12,240.27 291.12,238.49 v292.64,236.97 | v307.38,236.46 308.39,235.45 v308.39,227.32
!07  (via drill 0.61)
  Top 0.254: v129.07,217.92 127.29,216.14 120.43,216.14 119.67,216.9 A23.S2 | v150.15,221.48 150.66,221.98 155.74,221.98 158.28,219.44 162.6,219.44 v162.85,219.7 | v163.87,214.62 165.64,212.84 170.47,212.84 171.23,213.6 171.74,213.6 172.25,213.09 173.77,213.09 174.53,213.86 v176.57,213.86 | v198.16,223.51 199.68,225.03 v205.27,225.03 | v210.35,225.54 210.6,225.79 211.87,225.79 213.4,227.32 v214.92,227.32 | v301.03,217.67 302.55,216.14 304.58,216.14 306.11,217.67 307.38,217.67 308.9,216.14 316.01,216.14 v316.27,215.89
  Route2 0.254: v129.07,217.92 133.64,222.49 149.13,222.49 v150.15,221.48 | v176.57,213.86 181.9,219.19 186.73,219.19 190.03,222.49 197.14,222.49 v198.16,223.51 | v289.6,207.76 290.36,208.52 290.87,208.52 294.42,212.08 295.69,212.08 301.03,217.41 v301.03,217.67 | v315.25,220.97 317.28,223 317.28,227.06 318.55,228.33 322.36,228.33 323.89,229.86 323.89,231.89 324.9,232.91 A07.L1
  Route15 0.254: v205.27,225.03 209.84,225.03 v210.35,225.54 | v214.92,227.32 215.94,227.32 220.51,231.89 v226.86,231.89 | v242.61,224.02 v239.3,227.32 | v246.42,220.97 247.69,220.97 248.7,221.98 258.61,221.98 264.45,216.14 264.45,213.86 272.07,206.24 272.07,205.98 279.44,198.62 v284.52,198.62
  Bottom 0.254: v162.85,219.7 162.34,219.19 162.34,216.14 v163.87,214.62 | v226.86,231.89 228.13,231.89 228.64,232.4 229.4,232.4 229.4,232.14 230.16,231.38 238.54,231.38 238.54,228.08 v239.3,227.32 | v242.61,224.02 244.89,224.02 244.89,222.49 v246.42,220.97 | v284.52,198.62 286.04,198.62 286.04,198.87 287.31,200.14 287.31,205.47 v289.6,207.76 | v316.27,215.89 314.74,215.89 314.74,220.46 v315.25,220.97
!76  (via drill 0.61)
  Top 0.254: v328.46,80.51 331.25,80.51 C06.T2 | v267.75,95.24 267.5,94.98 260.89,94.98 257.34,91.43 v256.07,91.43
  Route2 0.254: v328.46,80.51 326.93,78.98 321.35,78.98 315.25,72.89 v313.22,72.89 | v311.95,59.42 304.07,67.3 293.41,67.3 292.9,67.81 290.61,67.81 274.86,83.55 274.86,84.57 v269.02,90.41
  Route15 0.254: v256.07,91.43 250.73,86.09 250.73,78.98 v249.72,77.97 | v247.69,45.71 247.94,45.45 247.94,41.9 254.8,35.04 254.8,33.77 v254.54,33.52
  Bottom 0.254: D12.S2 258.1,14.72 256.07,16.75 D12.R2 255.05,18.02 255.05,20.31 254.29,21.07 254.29,33.26 v254.54,33.52 | v313.22,72.89 312.2,71.87 312.2,59.68 v311.95,59.42 | v269.02,90.41 266.99,92.44 266.99,94.48 v267.75,95.24 | v249.72,77.97 247.94,76.19 247.94,73.65 248.45,73.14 248.45,56.63 247.69,55.87 v247.69,45.71
!77  (via drill 0.61)
  Top 0.254: D12.T2 256.07,10.4 258.1,8.37 D12.U2 | v336.84,69.33 336.33,68.82 335.57,68.82 333.03,66.28 v325.41,66.28 | v325.92,58.15 326.17,57.9 326.93,57.9 327.7,57.14 327.7,54.34 316.01,54.34 v315.5,54.85 | v314.23,41.14 302.8,41.14 v302.55,41.39 | v290.87,36.82 289.85,37.83 286.8,37.83 285.28,36.31 v284.01,36.31 | v275.12,27.17 273.59,25.64 270.8,25.64 v269.78,26.66 | v269.78,14.72 268.01,12.94 263.94,12.94 v261.91,14.97
  Route2 0.254: v336.84,69.33 332.27,73.9 C06.V2 | v302.55,41.39 301.53,40.37 300.52,40.37 298.49,38.34 295.44,38.34 294.68,39.1 293.15,39.1 v290.87,36.82 | v283.5,28.69 282.99,28.18 276.13,28.18 v275.12,27.17
  Route15 0.254: v315.5,54.85 314.49,53.84 v314.49,49.01
  Bottom 0.254: v325.41,66.28 325.92,65.77 v325.92,58.15 | v314.49,49.01 314.23,48.76 v314.23,41.14 | v284.01,36.31 283.75,36.06 283.75,34.79 282.99,34.02 282.99,29.2 v283.5,28.69 | v269.78,26.66 v269.78,14.72 | v261.91,14.97 261.15,14.21 261.15,12.43 259.12,10.4 259.12,8.62 D12.U2
!ADDR_ACC  (via drill 0.61)
  Top 0.254: v198.92,90.92 200.95,90.92 C17.P1 | v196.63,93.46 195.11,94.98 189.27,94.98 v188.76,94.48 | v182.66,88.89 182.41,88.63 178.09,88.63 175.55,86.09 171.74,86.09 v170.22,87.62 | v167.68,84.32 166.15,82.79 118.15,82.79 v116.37,84.57 | v115.1,102.86 100.37,117.59 v89.7,117.59 | v89.95,191.25 90.46,190.74 94.27,190.74 95.29,191.76 v95.29,192.52 | v96.05,201.16 96.56,200.65 100.37,200.65 101.38,199.63 217.46,199.63 218.48,200.65 220.25,200.65 221.78,199.12 251.75,199.12 252.77,200.14 264.96,200.14 266.48,201.66 v280.96,201.66 | v284.26,189.47 284.52,189.22 285.79,189.22 287.06,190.49 v287.56,190.49 | v293.66,190.49 293.91,190.23 295.95,190.23 298.49,187.69 307.63,187.69 308.39,188.46 309.66,188.46 312.71,185.41 v313.22,185.41
  Route2 0.254: v188.76,94.48 185.46,91.17 184.69,91.17 183.93,90.41 183.93,89.9 182.92,88.89 v182.66,88.89 | v170.22,87.62 170.22,86.35 168.18,84.32 v167.68,84.32 | v287.56,190.49 v293.66,190.49
  Route15 0.254: v313.22,185.41 311.44,183.63 311.44,152.13 310.17,150.86 310.17,150.1 306.87,146.8 306.87,145.02 B08.T2
  Bottom 0.254: v198.92,90.92 196.63,93.21 v196.63,93.46 | v116.37,84.57 114.59,86.35 114.59,102.35 v115.1,102.86 | v89.7,117.59 89.19,118.1 89.19,190.49 v89.95,191.25 | v95.29,192.52 96.05,193.28 v96.05,201.16 | v280.96,201.66 281.98,200.65 281.98,194.55 282.74,193.79 282.74,191 v284.26,189.47
!B-BRK  (via drill 0.61)
  Top 0.254: B02.P1 391.7,154.67 391.7,155.18 390.18,156.71 390.18,159.75 386.37,159.75 B02.M2 385.1,160.01 v382.81,160.01 | v391.45,168.39 390.69,168.39 389.67,169.41 B02.J1 | v382.81,136.39 378.5,132.07 324.9,132.07 322.87,134.1 317.28,134.1 316.27,133.08 296.2,133.08 295.44,133.85 288.83,133.85 288.33,134.35 284.52,134.35 281.47,137.4 B10.V2
  Bottom 0.254: 390.94,167.88 v391.45,168.39 | 390.94,167.88 390.94,155.44 391.7,154.67 B02.P1 | 390.94,167.88 390.94,184.39 391.7,185.15 B02.C1 | v382.81,136.39 383.83,137.4 383.83,142.99 | 383.83,142.99 383.07,143.75 B02.T2 | 383.83,160.01 383.83,142.99 | 383.83,160.01 383.83,170.68 383.58,170.93 383.58,174.99 383.07,175.5 B02.F2 | 383.83,160.01 v382.81,160.01
!BAC_00  (via drill 0.61)
  Top 0.254: v273.59,47.74 278.17,47.74 282.74,43.17 286.8,43.17 D10.F1 | v271.56,44.44 271.31,44.18 253.78,44.18 250.73,41.14 234.73,41.14 233.72,42.15 231.43,42.15 230.92,41.64 165.39,41.64 v163.87,43.17 | v168.18,206.74 173.52,212.08 175.3,212.08 175.55,212.33 234.48,212.33 v234.99,211.82 | v235.24,215.63 235.75,216.14 249.97,216.14 250.48,216.65 251.24,216.65 251.75,216.14 260.13,216.14 v261.66,217.67 | v270.04,227.06 270.29,227.32 272.32,227.32 273.85,225.79 294.68,225.79 v295.44,226.56 | v300.26,192.52 302.55,190.23 336.33,190.23 337.86,191.76 340.65,191.76 B06.A1 341.92,192.52 344.46,192.52 v344.71,192.77 | v382.31,141.72 391.2,150.61 v392.47,150.61 | v395.01,154.93 396.53,156.45 396.53,158.74 v395.77,158.74 | v397.04,162.8 397.04,165.34 v395.77,165.34 | v404.4,188.71 404.4,190.74 403.64,190.74 398.82,195.57 362.75,195.57 359.45,198.87 349.29,198.87 348.78,198.36 v344.21,198.36
  Route2 0.254: v376.72,133.34 376.72,133.85 381.29,138.42 381.29,140.7 v382.31,141.72 | v392.47,150.61 392.47,152.39 v395.01,154.93
  Route15 0.254: v268.01,223.51 v265.47,220.97 | v396.02,174.49 400.34,178.8 400.34,184.65 v404.4,188.71
  Bottom 0.254: v273.59,47.74 272.83,46.98 272.83,45.45 271.82,44.44 v271.56,44.44 | v163.87,43.17 162.34,44.69 162.34,59.68 164.12,61.46 164.12,76.44 164.88,77.2 164.88,168.14 164.12,168.9 164.12,171.69 165.39,172.96 165.39,178.04 168.18,180.84 v168.18,206.74 | v234.99,211.82 235.24,212.08 v235.24,215.63 | v261.66,217.67 264.96,220.97 v265.47,220.97 | v268.01,223.51 269.78,225.29 269.78,226.81 v270.04,227.06 | v295.44,226.56 295.18,226.3 295.18,221.98 295.69,221.48 295.69,219.7 296.71,218.68 298.23,218.68 298.23,196.33 300.26,194.3 v300.26,192.52 | v376.72,133.34 377.23,132.83 377.23,126.48 376.72,125.97 C03.B1 | v395.77,158.74 395.77,161.53 v397.04,162.8 | v395.77,165.34 396.53,166.1 396.53,173.98 v396.02,174.49 | v344.21,198.36 344.21,193.28 v344.71,192.77
!BAC_01  (via drill 0.61)
  Top 0.254: v290.87,42.66 295.69,47.49 301.28,47.49 302.55,48.76 304.84,48.76 305.6,47.99 307.88,47.99 310.42,50.53 314.23,50.53 315,49.77 317.79,49.77 318.55,50.53 326.93,50.53 327.7,49.77 330.49,49.77 331.76,51.04 v343.7,51.04 | v345.22,65.77 347.25,67.81 386.12,67.81 v386.62,67.3 | v385.61,75.68 380.78,80.51 v379.77,80.51 | v338.62,186.17 340.14,187.69 v353.6,187.69 | v354.87,203.7 354.37,204.2 332.27,204.2 331.25,203.19 v327.44,203.19 | v322.36,258.05 321.85,257.54 298.74,257.54 298.23,258.05 v295.95,258.05 | v254.8,235.7 253.78,234.68 196.89,234.68 194.35,232.14 169.2,232.14 v168.44,232.91 | v165.39,67.3 165.9,66.79 171.99,66.79 172.5,66.28 176.57,66.28 177.07,65.77 184.19,65.77 184.69,65.27 209.08,65.27 v209.59,65.77 | v212.63,22.09 227.11,22.09 228.13,23.1 228.89,23.1 229.4,22.59 254.04,22.59 257.34,19.29 278.93,19.29 281.21,21.58 283.25,21.58 283.75,22.09 v289.09,22.09
  Route15 0.254: v379.77,80.51 378.24,82.03 378.24,104.64 v379.77,106.16
  Bottom 0.254: v290.87,42.66 290.87,40.37 D10.H1 290.1,39.1 289.34,38.34 289.34,22.34 v289.09,22.09 | v343.7,51.04 345.73,53.07 345.73,65.27 v345.22,65.77 | v386.62,67.3 386.62,74.66 v385.61,75.68 | v379.77,106.16 380.78,107.18 380.78,114.54 380.02,115.3 C03.E1 | v338.62,186.17 338.62,183.12 B06.D1 | v353.6,187.69 354.87,188.96 354.87,191 356.14,192.27 356.14,202.43 v354.87,203.7 | v327.44,203.19 327.44,210.3 326.93,210.81 326.93,253.48 v322.36,258.05 | v295.95,258.05 294.93,259.07 294.93,260.59 291.88,263.64 261.91,263.64 261.91,261.86 256.83,256.78 256.83,243.57 255.56,242.3 255.56,241.54 254.29,240.27 254.29,236.21 v254.8,235.7 | v168.44,232.91 165.39,229.86 165.39,213.35 169.2,209.54 169.2,193.28 168.69,192.77 168.69,183.63 170.72,181.6 170.72,180.58 171.23,180.07 171.23,176.26 168.18,173.22 168.18,161.53 165.39,158.74 v165.39,67.3 | v209.59,65.77 209.33,65.52 209.33,48.76 212.63,45.45 v212.63,22.09
!BAC_02  (via drill 0.61)
  Top 0.254: v315.5,11.93 316.01,12.43 v358.18,12.43 | v369.61,109.21 370.62,108.19 374.69,108.19 376.46,109.97 378.75,109.97 C03.H1 | v319.31,184.14 318.81,184.14 315.76,181.09 314.74,181.09 314.74,178.55 315.25,178.04 317.79,178.04 319.57,179.82 321.09,179.82 321.09,178.55 321.6,178.04 336.33,178.04 337.6,176.77 B06.F1 | v318.55,199.63 307.12,199.63 306.61,200.14 301.53,200.14 301.03,200.65 293.41,200.65 292.39,199.63 v285.53,199.63 | v286.04,210.81 286.8,211.57 v287.82,211.57 | v274.61,237.99 v286.8,237.99 | v272.07,238.75 271.82,238.49 259.37,238.49 v259.12,238.75 | v258.1,231.89 257.59,231.38 v228.89,231.38 | v228.38,221.22 226.6,219.44 210.09,219.44 209.59,219.95 208.06,219.95 205.01,216.9 202.98,216.9 201.71,215.63 v146.59,215.63 | v149.39,59.68 149.9,60.19 178.34,60.19 181.65,56.88 212.63,56.88 213.65,55.87 v214.67,55.87 | v224.83,50.53 225.59,49.77 228.89,49.77 229.65,50.53 231.43,50.53 232.45,49.52 v233.72,49.52 | v242.35,57.9 242.86,57.39 249.21,57.39 v249.72,57.9
  Route2 0.254: v356.4,47.74 355.89,48.25 355.89,50.03 360.21,54.34 360.46,54.34 363.51,57.39 363.51,64.5 355.89,72.12 355.89,103.87 357.16,105.14 365.54,105.14 v369.61,109.21 | v274.61,237.99 274.1,238.49 272.32,238.49 v272.07,238.75 | v214.67,55.87 216.7,53.84 222.03,53.84 224.83,51.04 v224.83,50.53 | v233.72,49.52 242.1,57.9 v242.35,57.9 | v249.72,57.9 253.02,61.2 271.05,61.2 272.58,59.68 276.9,59.68 277.15,59.93 280.96,59.93 v284.01,56.88
  Route15 0.254: v313.47,14.47 302.8,25.13 301.03,25.13 297.98,28.18 297.47,28.18 296.2,29.45 296.2,29.71 289.85,36.06 288.07,36.06 D10.J1
  Bottom 0.254: v313.47,14.47 315.5,12.43 v315.5,11.93 | v358.18,12.43 358.68,12.94 358.68,45.45 v356.4,47.74 | v319.31,184.14 317.79,185.66 317.79,197.85 318.55,198.62 v318.55,199.63 | v285.53,199.63 286.04,200.14 v286.04,210.81 | v287.82,211.57 285.53,213.86 285.53,232.14 286.04,232.65 286.04,237.22 v286.8,237.99 | v259.12,238.75 257.59,237.22 257.59,232.4 v258.1,231.89 | v228.89,231.38 228.38,230.87 v228.38,221.22 | v146.59,215.63 146.34,215.38 146.34,195.31 146.85,194.81 146.85,189.98 146.34,189.47 146.34,151.37 143.29,148.32 143.29,65.77 v149.39,59.68 | v284.01,56.88 285.53,55.36 285.53,41.14 287.06,39.61 287.06,37.07 D10.J1
!BAC_03  (via drill 0.61)
  Top 0.254: v294.17,33.01 291.12,33.01 D10.K1 | v318.81,21.07 319.06,20.82 320.08,20.82 321.6,19.29 v327.7,19.29 | v335.32,169.41 337.6,169.41 B06.J1 | v379.26,100.57 379.26,102.6 C03.K1 | v367.83,73.39 367.32,72.89 353.1,72.89 v352.59,73.39 | v352.59,30.47 352.59,28.69 347.51,28.69 v347,29.2 | v347,24.12 345.22,22.34 341.92,22.34 340.9,23.36 340.4,23.36 v336.84,19.8
  Route2 0.254: v332.01,160.77 332.01,161.79 333.79,163.56 333.79,167.88 v335.32,169.41 | v376.72,98.03 v379.26,100.57 | v375.96,96.25 375.96,95.24 371.13,90.41 371.13,77.71 367.83,74.41 v367.83,73.39
  Route15 0.254: v294.17,33.01 295.18,33.01 299.5,28.69 300.01,28.69 302.04,26.66 302.04,26.15 302.55,25.64 306.87,25.64 307.38,25.13 313.98,25.13 318.04,21.07 v318.81,21.07
  Bottom 0.254: v327.7,19.29 330.49,19.29 | 330.49,19.29 330.49,67.04 330.74,67.3 330.74,70.85 331,71.11 331,73.39 330.49,73.9 330.49,128.26 331.25,129.02 331.25,134.35 330.49,135.12 330.49,157.98 332.01,159.5 v332.01,160.77 | v376.72,98.03 375.96,97.27 v375.96,96.25 | v352.59,30.47 v352.59,73.39 | v347,29.2 346.49,28.69 346.49,24.63 v347,24.12 | v336.84,19.8 333.79,16.75 333.79,11.16 332.52,9.89 330.49,9.89 330.49,19.29
!BAC_04  (via drill 0.61)
  Top 0.254: v315.25,31.74 315.5,31.99 317.79,31.99 318.55,32.75 319.82,32.75 | 319.82,32.75 320.84,32.75 321.6,31.99 326.93,31.99 v327.95,30.98 | v329.22,22.85 333.28,18.78 v347,18.78 | v357.41,38.85 359.45,40.88 376.21,40.88 376.97,40.12 376.97,38.6 v376.72,38.6 | v344.46,160.26 344.21,160.26 342.94,161.53 340.4,161.53 338.87,163.06 B06.L1 | v325.66,46.98 328.2,44.44 v328.46,44.44 | v328.97,41.39 328.46,40.88 327.95,40.88 326.43,39.36 v326.43,38.85 | 319.82,32.75 v322.62,35.55
  Route2 0.254: v315.25,31.74 307.12,39.87 306.11,39.87 301.79,44.18 296.96,44.18 288.07,35.29 286.29,35.29 284.77,33.77 D10.K2 | v341.16,138.42 333.03,130.29 333.03,124.7 325.66,117.34 324.65,117.34 323.63,116.32 323.63,115.3 v322.62,114.29 | v326.43,38.85 325.41,37.83 324.9,37.83 v322.62,35.55
  Route15 0.254: v376.72,38.6 377.99,39.87 377.99,74.41 380.78,77.2 380.78,92.19 379.26,93.71 379.26,96.25 C03.M1 | v344.46,160.26 342.68,158.48 342.68,139.94 v341.16,138.42 | v321.85,112.51 323.63,110.73 323.63,76.19 321.09,73.65 v321.09,71.36 | v321.09,60.19 320.84,59.93 320.84,51.8 v325.66,46.98
  Bottom 0.254: v327.95,30.98 327.44,30.47 327.44,24.63 v329.22,22.85 | v347,18.78 346.49,18.28 346.49,11.16 349.54,8.12 349.54,4.05 350.05,3.54 355.89,3.54 355.89,37.33 v357.41,38.85 | v322.62,114.29 321.85,113.53 v321.85,112.51 | v321.09,60.19 v321.09,71.36 | v328.46,44.44 328.97,43.93 v328.97,41.39
!BAC_05  (via drill 0.61)
  Top 0.254: v341.67,150.86 v338.62,153.91 | v344.71,116.32 346.49,114.54 357.41,114.54 v359.95,112
  Route2 0.254: v341.92,134.1 345.73,130.29 345.73,117.34 v344.71,116.32 | v361.22,99.81 361.22,99.3 365.03,95.49 365.03,94.73 367.32,92.44 370.88,92.44 375.7,97.27 376.21,97.27 379,94.48 379,91.17 C03.P1
  Bottom 0.254: v338.62,153.91 338.62,156.45 B06.N1 | v341.67,150.86 340.14,150.86 340.14,135.88 v341.92,134.1 | v359.95,112 361.73,110.22 361.73,100.32 v361.22,99.81
!BAC_06  (via drill 0.61)
  Top 0.254: v385.35,93.46 384.34,92.44 366.81,92.44 v364.02,95.24
  Route2 0.254: v385.35,93.46 381.8,89.9 381.8,88.89 379.77,86.86 379.77,84.82 C03.S1 | v367.07,101.59 371.13,105.65 371.13,108.95 367.83,112.26 v367.07,112.26 | v366.3,118.61 366.3,120.64 365.29,121.65 365.29,128.51 358.43,135.37 358.43,139.43 342.68,155.18 340.65,155.18 339.63,154.17 339.63,152.39 338.62,151.37 B06.R1
  Bottom 0.254: v364.02,95.24 365.54,96.76 365.54,100.06 v367.07,101.59 | v367.07,112.26 365.54,113.78 365.54,117.84 v366.3,118.61
!BAC_07  (via drill 0.61)
  Top 0.254: v338.11,108.19 336.84,106.92 336.84,104.64 339.38,104.64 339.63,104.38 342.17,104.38 v347.25,99.3 | v351.32,88.89 351.57,88.63 358.94,88.63 361.48,86.09 366.3,86.09 v366.56,86.35 | v369.61,79.24 372.4,76.44 377.73,76.44 378.75,77.46 C03.U1
  Route2 0.254: v348.02,92.95 348.02,92.19 v351.32,88.89 | v366.56,86.35 368.59,84.32 368.59,80.25 v369.61,79.24
  Route15 0.254: v338.11,108.19 336.84,109.46 336.84,134.1 337.6,134.86 337.6,137.15 337.86,137.4 B06.V1
  Bottom 0.254: v347.25,99.3 346.49,98.54 346.49,95.49 348.02,93.97 v348.02,92.95
!BAC_08  (via drill 0.61)
  Top 0.254: v369.61,142.23 367.57,144.26 v366.56,144.26 | v347.51,156.45 347.51,156.96 346.24,158.23 346.24,162.8 v347.51,162.8
  Route2 0.254: v366.56,144.26 358.18,152.64 352.59,152.64 348.78,156.45 v347.51,156.45 | v347.51,162.8 345.22,165.09 345.22,165.34 343.44,167.12 343.19,167.12 342.43,167.88 342.43,168.39 342.68,168.64 342.68,169.15 339.63,172.2 339.63,180.33 v341.16,181.85
  Route15 0.254: v370.11,117.34 371.13,118.35 371.13,134.86 368.59,137.4 368.59,138.67 v369.61,139.69
  Bottom 0.254: v370.11,117.34 370.11,113.27 C03.F2 | v369.61,139.69 v369.61,142.23 | v341.16,181.85 341.16,185.15 B06.C1
!BAC_09  (via drill 0.61)
  Top 0.254: v362.49,62.98 362.75,62.73 373.16,62.73 v374.18,63.74
  Route2 0.254: v334.55,75.93 334.55,75.43 342.68,67.3 344.46,67.3 344.97,66.79 346.24,66.79 352.84,60.19 354.62,60.19 358.94,55.87 358.94,55.61 359.7,54.85 360.21,54.85 362.49,57.14 v362.49,59.93
  Route15 0.254: v334.55,175.5 333.54,174.49 333.54,77.2 334.55,76.19 v334.55,75.93 | v374.18,63.74 371.64,66.28 371.64,100.32 v370.11,101.84
  Bottom 0.254: v334.55,175.5 334.55,178.8 B06.E2 | v362.49,59.93 v362.49,62.98 | v370.11,101.84 370.11,105.65 C03.J2
!BAC_10  (via drill 0.61)
  Top 0.254: v319.06,249.67 320.84,247.89 323.12,247.89 325.66,250.43 330.49,250.43 331.25,249.67 332.52,249.67 335.32,246.88 v336.08,246.88 | v370.11,59.42 368.08,57.39 351.06,57.39 v350.56,57.9 | v348.02,55.87 346.24,54.09 v343.7,54.09 | v343.19,60.69 342.68,61.2 v337.09,61.2 | v337.09,64.76 336.59,64.25 325.66,64.25 325.16,64.76 v311.19,64.76 | v309.92,87.11 311.44,88.63 315,88.63 316.01,87.62 317.54,87.62 319.06,89.14 323.63,89.14 v324.65,90.16 | v328.97,95.24 v324.9,95.24 | v331.51,116.32 v328.97,113.78 | v332.01,172.45 332.27,172.71 334.3,172.71 B06.H2
  Route2 0.254: v316.27,246.88 313.47,249.67 311.19,249.67 310.42,250.43 308.9,250.43 308.65,250.18 304.33,250.18 304.07,250.43 303.57,250.43 302.55,251.45 302.55,251.96 300.77,253.73 286.8,253.73 284.77,251.7 281.98,251.7 281.72,251.96 A10.D2 | v335.06,200.14 334.05,199.12 333.54,199.12 331.25,196.84 331.25,190.23 330.49,189.47 330.49,179.57 333.54,176.52 333.54,174.74 334.55,173.72 B06.H2 | v350.56,57.9 348.52,55.87 v348.02,55.87 | v328.97,95.24 329.98,96.25 329.98,112.76 v328.97,113.78
  Route15 0.254: v335.82,225.29 336.33,224.78 336.33,208.52 v335.32,207.51 | v370.11,97.27 371.13,96.25 371.13,64.76 v370.11,63.74 | v331.51,116.32 333.03,117.84 333.03,171.44 v332.01,172.45
  Bottom 0.254: v316.27,246.88 v319.06,249.67 | v336.08,246.88 336.84,246.11 336.84,244.34 338.11,243.07 338.11,241.54 336.33,239.76 336.33,225.79 v335.82,225.29 | v335.32,207.51 335.06,207.25 v335.06,200.14 | v370.11,97.27 370.11,99.3 C03.L2 | v370.11,59.42 v370.11,63.74 | v343.7,54.09 343.19,54.6 v343.19,60.69 | v337.09,64.76 v337.09,61.2 | v311.19,64.76 310.17,65.77 310.17,76.44 310.93,77.2 310.93,84.82 309.92,85.84 v309.92,87.11 | v324.65,90.16 324.14,90.67 324.14,94.48 v324.9,95.24
!BAC_11  (via drill 0.61)
  Top 0.254: v328.97,74.41 330.49,72.89 v338.36,72.89 | v337.86,88.89 338.11,89.14 342.94,89.14 v344.71,90.92 | v352.59,104.13 352.59,102.6 353.35,101.84 v357.41,101.84 | v324.65,161.28 325.66,162.29 329.98,162.29 329.98,166.1 331.25,167.37 334.05,167.37 334.3,167.12 B06.K2 | v309.66,112 v312.46,114.8
  Route2 0.254: v313.22,46.47 305.09,54.6 305.09,55.36 303.57,56.88 303.06,56.88 297.72,62.22 294.68,62.22 288.58,68.31 283.75,68.31 278.93,73.14 278.93,74.66 268.77,84.82 268.77,86.6 C11.R2 | v322.36,67.81 324.39,69.84 325.16,69.84 328.97,73.65 v328.97,74.41 | v338.36,72.89 337.86,73.39 337.35,73.39 336.84,73.9 336.84,86.09 | 336.84,86.09 336.84,87.87 v337.86,88.89 | v344.71,90.92 v350.56,96.76 | v357.41,101.84 362.24,101.84 363,102.6 363.51,102.6 368.59,97.52 368.59,94.98 369.35,94.22 C03.N2 | v309.66,112 309.66,111.49 321.09,100.06 321.09,96 331,86.09 336.84,86.09
  Route15 0.254: v313.22,46.47 311.44,48.25 311.44,56.12 312.71,57.39 313.73,57.39 314.74,58.41 314.74,60.19 v322.36,67.81 | v324.65,161.28 323.63,160.26 323.63,158.48 v322.62,157.47 | v320.58,151.88 320.33,151.63 320.33,148.83 v319.06,147.56 | v318.55,141.21 318.04,140.7 318.04,138.93 315.5,136.39 v315.5,130.54
  Bottom 0.254: v350.56,96.76 351.83,98.03 351.83,99.05 352.59,99.81 v352.59,104.13 | v322.62,157.47 320.58,155.44 v320.58,151.88 | v319.06,147.56 317.79,146.29 317.79,141.97 v318.55,141.21 | v315.5,130.54 314.23,129.27 314.23,116.57 v312.46,114.8
!BLK_IN_SYNC  (via drill 0.61)
  Top 0.254: v253.27,86.86 249.97,86.86 C13.R1 | v255.31,85.59 255.56,85.84 v259.12,85.84 | v287.31,262.62 289.6,262.62 289.85,262.37 A10.A1 | v186.22,179.57 187.74,178.04 200.44,178.04 v201.2,177.28 | v192.31,135.37 193.58,134.1 207.05,134.1 v207.81,134.86 | v230.41,103.37 231.94,101.84 241.59,101.84 245.4,105.65 v245.91,105.65
  Route2 0.254: v253.27,86.86 254.54,85.59 v255.31,85.59 | v259.12,85.84 261.15,83.81 261.91,83.81 278.93,66.79 278.93,66.54 288.58,56.88 288.58,42.15 283.25,36.82 281.72,36.82 D10.J2 | v287.31,262.62 285.53,264.4 239.81,264.4 v238.03,262.62 | v195.36,239.51 183.17,227.32 v182.92,227.32 | v182.92,188.96 182.92,187.44 184.44,185.92 184.44,181.34 v186.22,179.57 | v201.2,177.28 201.2,174.49 190.79,164.07 190.79,149.85 v192.57,148.07 | v226.86,114.03 226.86,111.75 228.89,109.72 228.89,104.89 v230.41,103.37
  Route15 0.254: v236.51,262.37 227.87,253.73 216.95,253.73 206.28,243.07 206.28,242.81 205.01,241.54 197.39,241.54 v195.36,239.51 | v211.62,129.02 218.98,121.65 218.98,118.86 220.76,117.08 222.29,117.08 225.33,114.03 v226.86,114.03 | v245.91,105.65 250.48,101.08 250.48,96.76 247.94,94.22 247.94,92.95 248.7,92.19 248.7,87.87 C13.R1
  Bottom 0.254: v238.03,262.62 236.51,262.62 v236.51,262.37 | v182.92,227.32 182.92,226.05 181.39,224.52 181.39,195.06 179.87,193.54 179.87,191.76 182.66,188.96 v182.92,188.96 | v192.57,148.07 192.31,147.82 192.31,146.55 190.79,145.02 190.79,142.99 191.3,142.48 191.3,139.18 190.79,138.67 190.79,137.4 192.31,135.88 v192.31,135.37 | v207.81,134.86 208.32,134.35 208.32,132.32 v211.62,129.02
!BMB_00
  Top 0.254: C02.B1 388.4,125.97 388.15,126.23 383.83,126.23 383.32,126.73 365.8,126.73 365.29,127.24 342.68,127.24 341.92,128 C06.A1
!BMB_01  (via drill 0.61)
  Top 0.254: v393.74,132.58 393.23,132.07 381.04,132.07 v380.53,132.58 | v380.53,135.37 380.27,135.62 364.78,135.62 364.27,135.12 355.89,135.12 354.87,134.1 v350.3,134.1 | v349.29,136.64 349.03,136.39 337.09,136.39 336.84,136.64 333.03,136.64 332.78,136.39 322.11,136.39 v321.35,137.15 | v322.62,119.11 323.89,117.84 336.84,117.84 337.6,118.61 C06.D1
  Bottom 0.254: v393.74,132.58 393.48,132.32 393.48,121.65 391.45,119.62 391.45,116.83 391.7,116.57 C02.E1 | v380.53,135.37 v380.53,132.58 | v350.3,134.1 349.29,135.12 v349.29,136.64 | v321.35,137.15 320.84,136.64 320.84,120.89 v322.62,119.11
!BMB_02  (via drill 0.61)
  Top 0.254: v392.21,104.89 391.96,104.64 380.78,104.64 380.27,105.14 372.91,105.14 372.4,104.64 365.8,104.64 365.29,105.14 358.68,105.14 358.18,104.64 353.35,104.64 352.84,105.14 351.06,105.14 v350.56,104.64 | v348.02,113.02 346.49,111.49 339.63,111.49 338.87,112.26 C06.F1
  Route2 0.254: v348.02,113.02 v350.56,115.56
  Bottom 0.254: v392.21,104.89 392.21,108.95 C02.H1 | v350.56,104.64 349.54,105.65 349.54,114.54 v350.56,115.56
!BMB_03  (via drill 0.61)
  Top 0.254: v353.35,98.54 353.35,99.56 351.57,101.33 345.98,101.33 342.43,104.89 339.89,104.89 338.87,105.91 C06.J1 | v353.1,79.74 353.6,79.24 366.05,79.24 v366.3,79.49 | v366.3,60.44 v394.24,60.44
  Bottom 0.254: v353.35,98.54 352.84,98.03 352.84,92.7 353.35,92.19 353.35,91.68 352.33,90.67 352.33,80.51 v353.1,79.74 | v366.3,79.49 365.54,78.73 365.54,76.95 366.3,76.19 v366.3,60.44 | v394.24,60.44 393.74,60.95 393.74,79.24 393.48,79.49 393.48,101.84 392.72,102.6 C02.K1
!BMB_04  (via drill 0.61)
  Top 0.254: v335.06,93.97 332.78,91.68 332.78,89.14 329.73,89.14 v329.47,88.89 | v329.98,71.36 v380.78,71.36 | v380.27,93.97 381.04,94.73 381.8,94.73 382.31,95.24 387.39,95.24 388.91,96.76 391.45,96.76 C02.M1
  Route2 0.254: v335.06,93.97 v337.86,96.76
  Bottom 0.254: v337.86,96.76 337.86,99.3 C06.L1 | v329.47,88.89 329.98,88.38 v329.98,71.36 | v380.78,71.36 380.78,93.46 v380.27,93.97
!BMB_05  (via drill 0.61)
  Top 0.254: v325.92,88.89 326.93,87.87 329.73,87.87 330.49,88.63 333.28,88.63 333.28,90.67 335.06,92.44 336.84,92.44 337.6,93.21 C06.N1 | v324.9,70.85 329.22,70.85 329.73,70.35 331,70.35 331.51,70.85 380.02,70.85 380.53,70.35 v397.8,70.35 | v397.8,88.63 396.53,89.9 392.72,89.9 C02.P1
  Bottom 0.254: v325.92,88.89 324.14,88.89 324.14,73.39 324.9,72.63 v324.9,70.85 | v397.8,70.35 397.29,70.85 397.29,88.13 v397.8,88.63
!BMB_06  (via drill 0.61)
  Top 0.254: v317.28,82.28 323.12,82.28 323.63,82.79 329.22,82.79 329.98,83.55 332.01,83.55 334.55,86.09 336.84,86.09 337.6,86.86 C06.R1 | v317.28,68.82 330.24,68.82 331.76,70.35 379.77,70.35 380.27,69.84 397.04,69.84 397.55,69.33 v399.83,69.33 | v399.83,82.28 399.32,82.79 397.04,82.79 396.28,83.55 392.72,83.55 C02.S1
  Bottom 0.254: v317.28,68.82 v317.28,82.28 | v399.83,69.33 v399.83,82.28
!BMB_07  (via drill 0.61)
  Top 0.254: v343.44,73.39 339.63,73.39 338.87,74.16 C06.V1 | v344.21,69.33 396.78,69.33 397.8,68.31 400.85,68.31 404.15,71.62 404.15,72.89 399.32,72.89 395.01,77.2 392.72,77.2 C02.U1
  Bottom 0.254: v343.44,73.39 344.21,72.63 v344.21,69.33
!BMB_08  (via drill 0.61)
  Top 0.254: v382.81,123.69 368.08,123.69 365.03,126.73 343.7,126.73 v341.67,124.7